# EAGLE design mp3player (EAGLE 4.11)
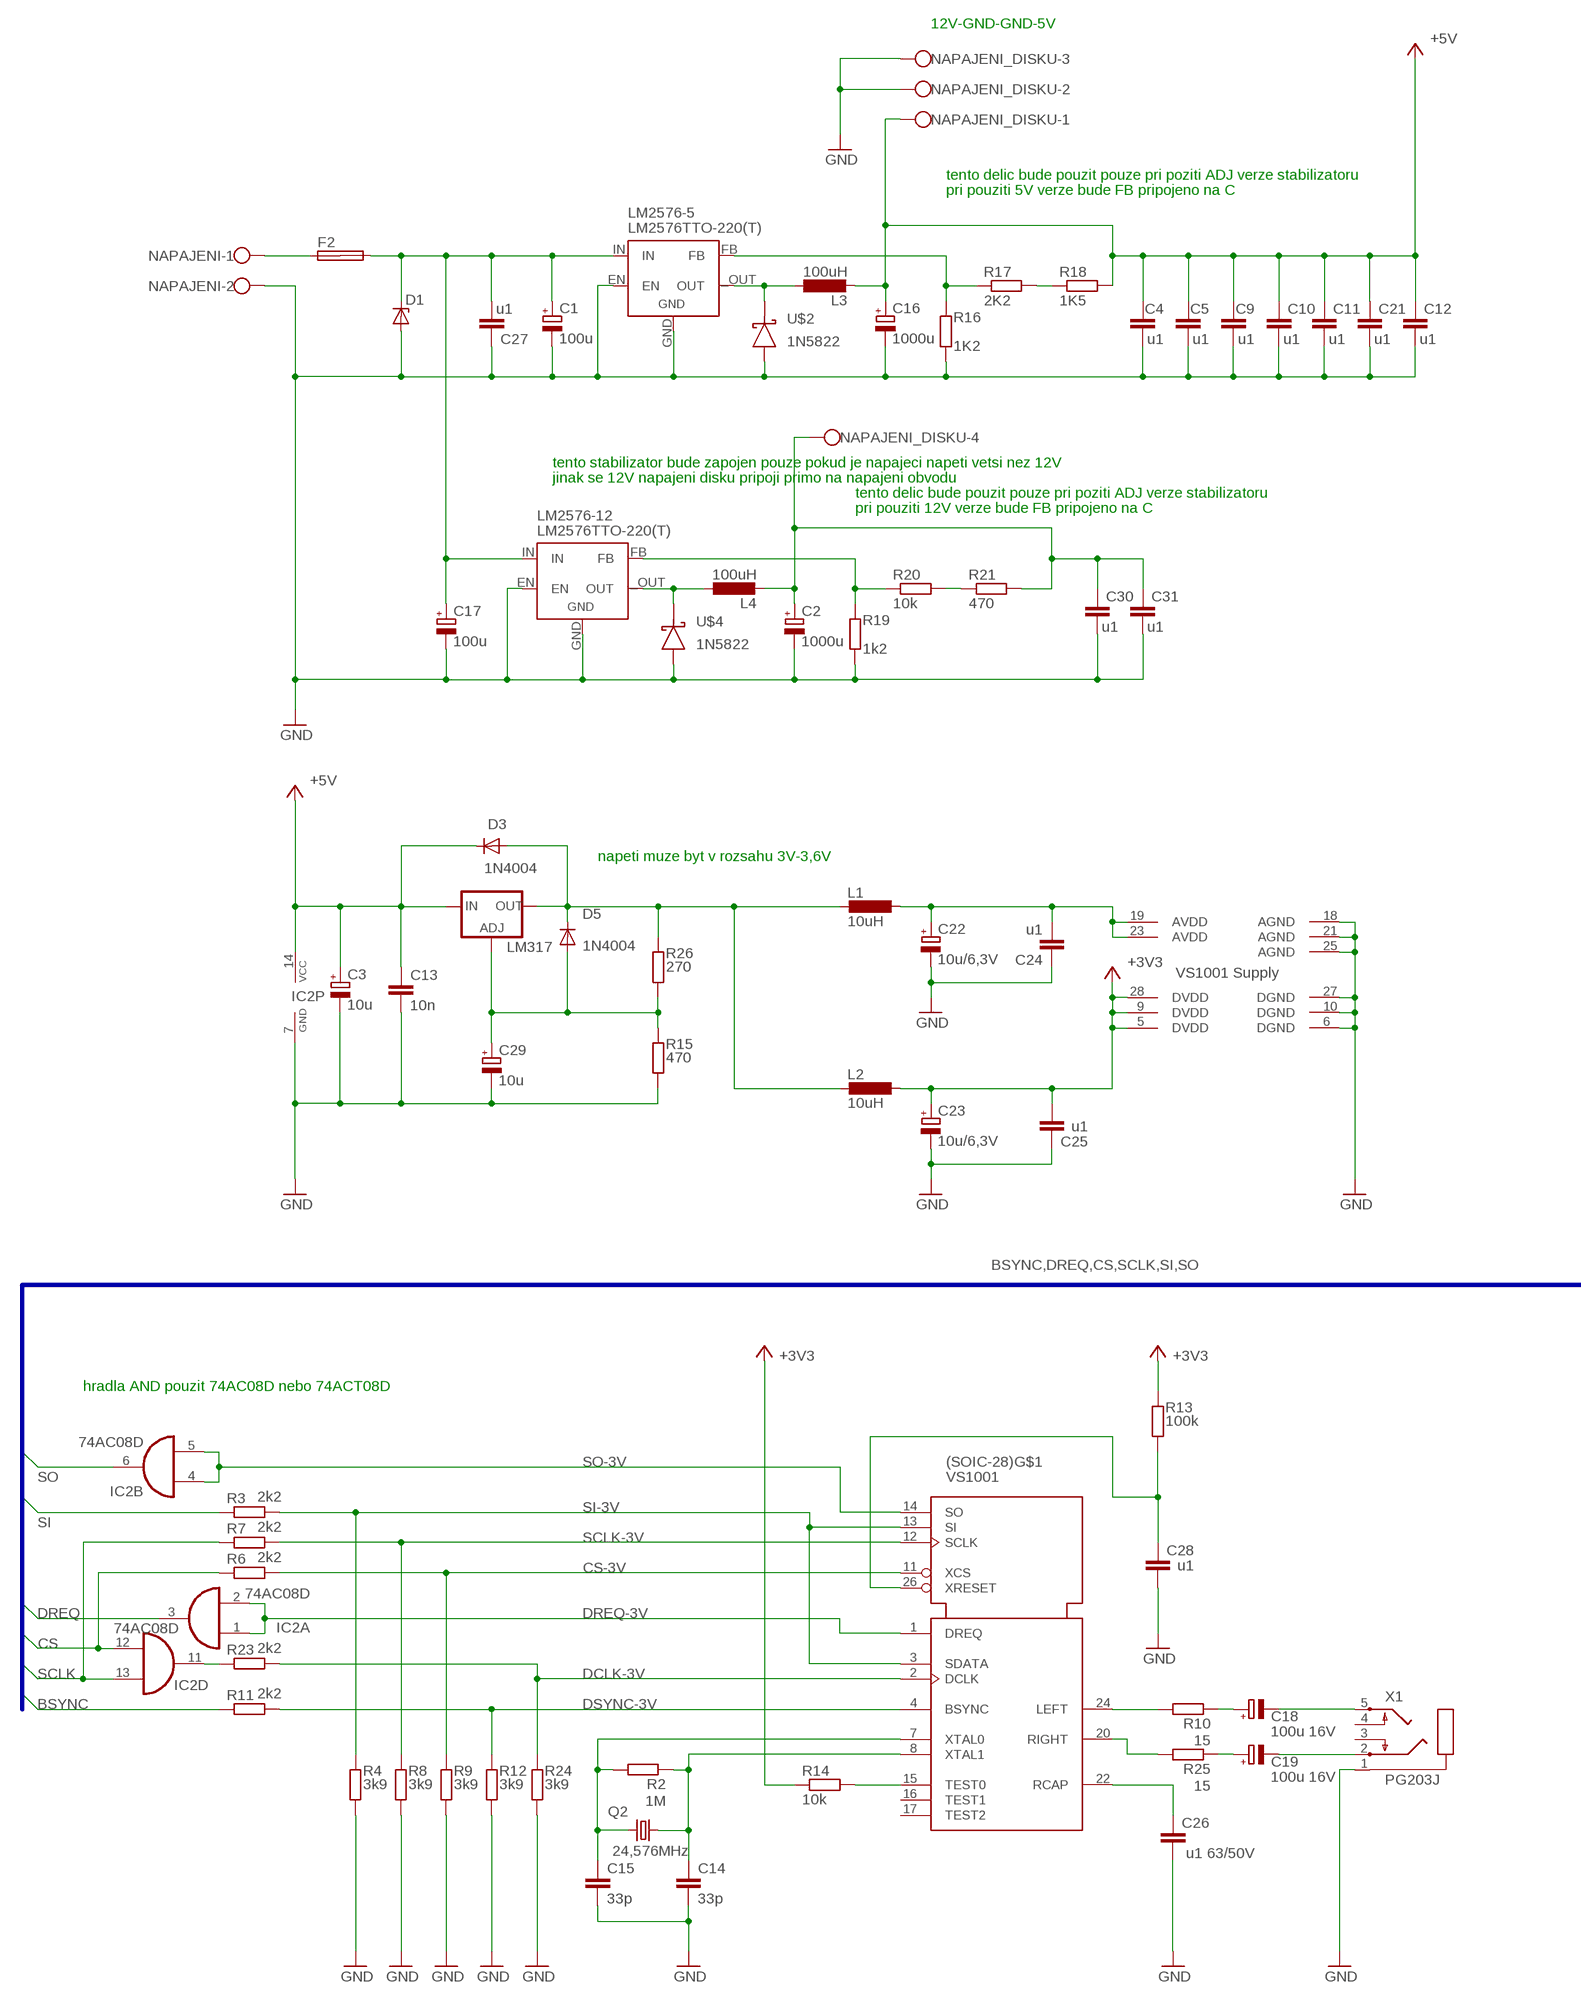
[diagram p0: schematic, sheet 1, part 1 of 2]
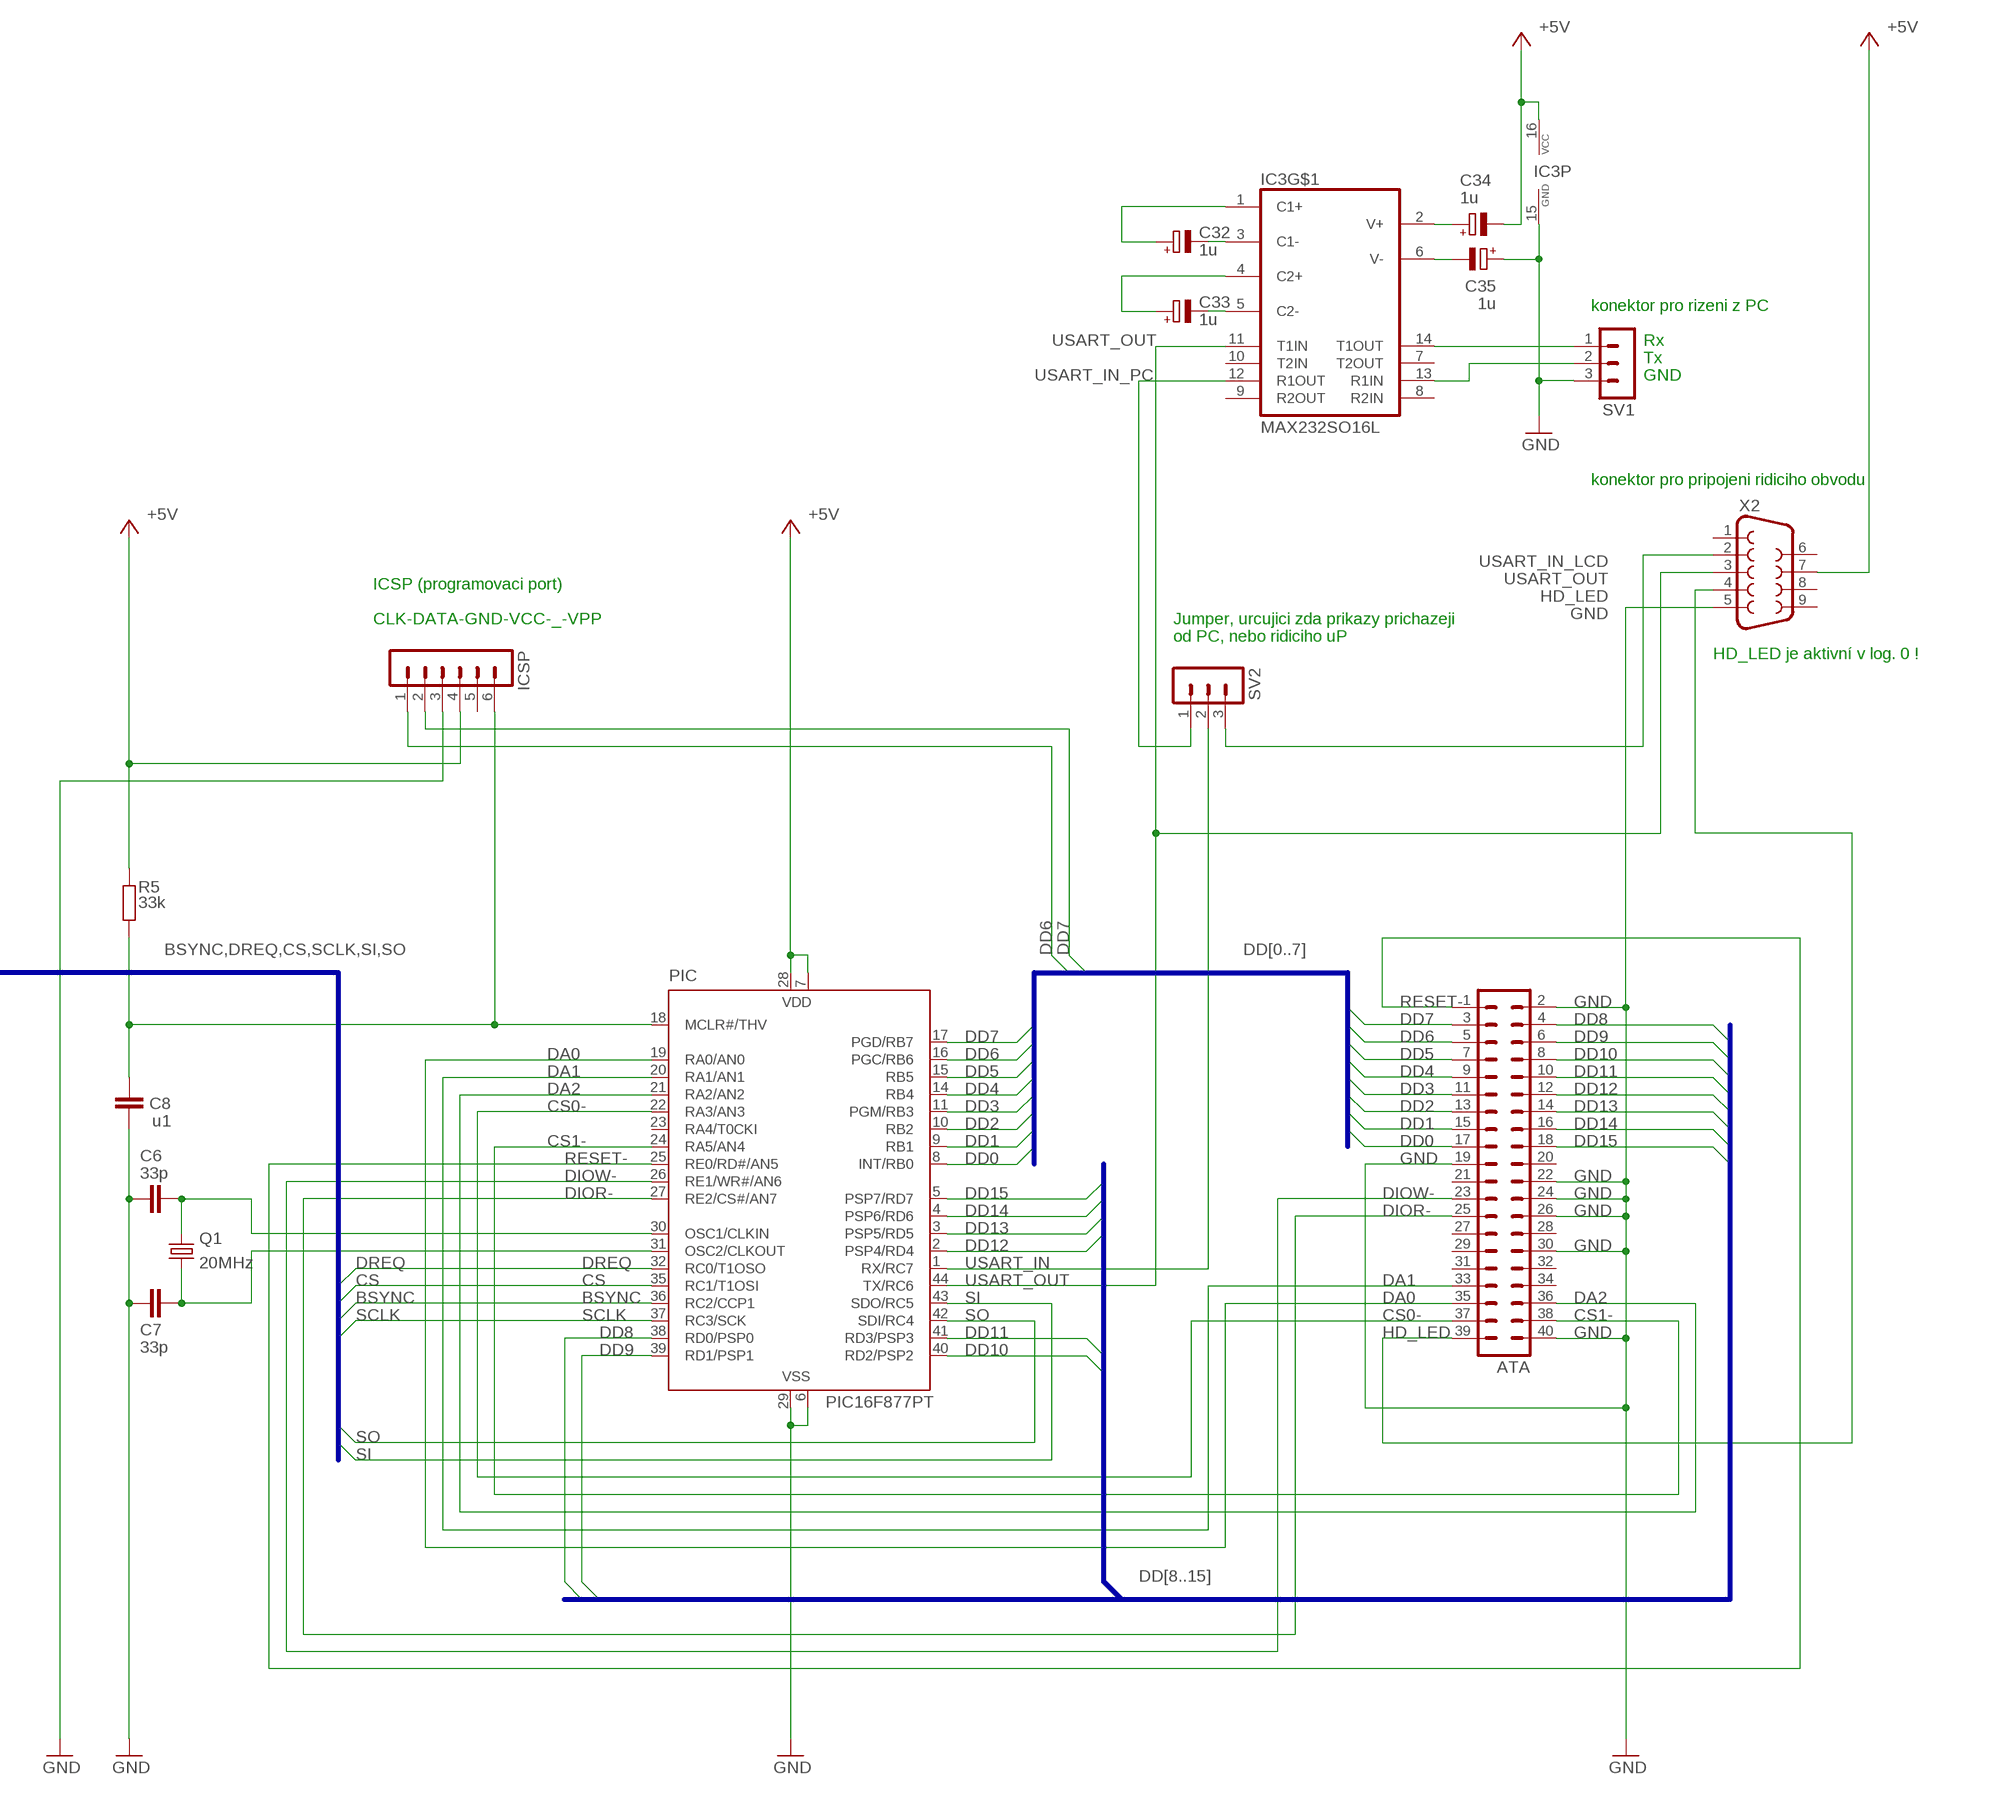
[diagram p1: schematic, sheet 1, part 2 of 2]

## Parts
(SOIC-28)  VS1001-SOIC-28  [SO-28L]
ATA  MA20-2  [MA20-2]
C1  100u  CPOL-EUE3.5-8  [E3,5-8]
C2  1000u  CPOL-EUE7.5-16  [E7,5-16]
C3  10u  CPOL-EUE1.8-4  [E1,8-4]
C4  u1  C-EUC1206  [C1206]
C5  u1  C-EUC1206  [C1206]
C6  33p  C-EUC0805  [C0805]
C7  33p  C-EUC0805  [C0805]
C8  u1  C-EUC1206  [C1206]
C9  u1  C-EUC1206  [C1206]
C10  u1  C-EUC1206  [C1206]
C11  u1  C-EUC1206  [C1206]
C12  u1  C-EUC1206  [C1206]
C13  10n  C-EUC1206  [C1206]
C14  33p  C-EUC1206  [C1206]
C15  33p  C-EUC1206  [C1206]
C16  1000u  CPOL-EUE7.5-16  [E7,5-16]
C17  100u  CPOL-EUE3.5-8  [E3,5-8]
C18  100u 16V  CPOL-EUE2,5-6E  [E2,5-6E]
C19  100u 16V  CPOL-EUE2,5-6E  [E2,5-6E]
C21  u1  C-EUC1206  [C1206]
C22  10u/6,3V  CPOL-EUE1.8-4  [E1,8-4]
C23  10u/6,3V  CPOL-EUE1.8-4  [E1,8-4]
C24  u1  C-EUC1206  [C1206]
C25  u1  C-EUC1206  [C1206]
C26  u1 63/50V  C-EUC1206  [C1206]
C27  u1  C-EUC1206  [C1206]
C28  u1  C-EUC1206  [C1206]
C29  10u  CPOL-EUE1.8-4  [E1,8-4]
C30  u1  C-EUC1206  [C1206]
C31  u1  C-EUC1206  [C1206]
C32  1u  CPOL-EUE2-5  [E2-5]
C33  1u  CPOL-EUE2-5  [E2-5]
C34  1u  CPOL-EUE2-5  [E2-5]
C35  1u  CPOL-EUE2-5  [E2-5]
D1  ZENER-DIODEF126-10  [F126Z10]
D3  1N4004  [DO41-10]
D5  1N4004  [DO41-10]
F2  SHK20L  [SHK20L]
IC2  74AC08D  [SO14]
IC3  MAX232SO16L  [SO16L]
ICSP  MA06-1  [MA06-1]
L1  10uH  L-EUL4516C  [L4516C]
L2  10uH  L-EUL4516C  [L4516C]
L3  100uH  L-EUTJ5-U2  [TJ5-U2]
L4  100uH  L-EUTJ5-U2  [TJ5-U2]
LM317  LM317TS  [317TS]
LM2576-5  LM2576TTO-220(T)  LM2576TTO-220T  [78XXS]
LM2576-12  LM2576TTO-220(T)  LM2576TTO-220T  [78XXS]
NAPAJENI  W237-102  [W237-102]
NAPAJENI_DISKU  W237-4  [W237-4]
PIC  PIC16F877PT  [TQFP44]
Q1  20MHz  CRYTALHC18U-V  [HC18U-V]
Q2  24,576MHz  CRYTALHC18U-V  [HC18U-V]
R2  1M  R-EU_R1206  [R1206]
R3  2k2  R-EU_R1206  [R1206]
R4  3k9  R-EU_R1206  [R1206]
R5  33k  R-EU_R1206  [R1206]
R6  2k2  R-EU_R1206  [R1206]
R7  2k2  R-EU_R1206  [R1206]
R8  3k9  R-EU_R1206  [R1206]
R9  3k9  R-EU_R1206  [R1206]
R10  15  R-EU_R1206  [R1206]
R11  2k2  R-EU_R1206  [R1206]
R12  3k9  R-EU_R1206  [R1206]
R13  100k  R-EU_M1206  [M1206]
R14  10k  R-EU_M1206  [M1206]
R15  470  R-EU_M1206  [M1206]
R16  1K2  R-EU_M1206  [M1206]
R17  2K2  R-EU_M1206  [M1206]
R18  1K5  R-EU_M1206  [M1206]
R19  1k2  R-EU_M1206  [M1206]
R20  10k  R-EU_M1206  [M1206]
R21  470  R-EU_M1206  [M1206]
R23  2k2  R-EU_R1206  [R1206]
R24  3k9  R-EU_R1206  [R1206]
R25  15  R-EU_R1206  [R1206]
R26  270  R-EU_M1206  [M1206]
SV1  MA03-1  [MA03-1]
SV2  MA03-1  [MA03-1]
U$2  1N5822  [DO201]
U$4  1N5822  [DO201]
X1  PG203J  [PG203J]
X2  F09HP  [F09HP]

## Nets
3V: D3.A D5.C L1.2 L2.2 LM317.2(OUT) R26.2
12V: C2.+ C30.2 C31.2 L4.2 NAPAJENI_DISKU.4 R21.2
470: R20.2 R21.1
+3V3: (SOIC-28).5(DVDD) (SOIC-28).9(DVDD) (SOIC-28).28(DVDD) C23.+ C25.2 L2.1 R13.2 R14.2
+5V: C3.+ C4.2 C5.2 C9.2 C10.2 C11.2 C12.2 C13.1 C16.+ C21.2 C34.- D3.C IC2.14(P:VCC) IC3.16(P:VCC) ICSP.4 L3.2 LM317.3(IN) NAPAJENI_DISKU.1 PIC.7(VDD) PIC.28(VDD) R5.2 R18.2 X2.7
AVDD: (SOIC-28).19(AVDD) (SOIC-28).23(AVDD) C22.+ C24.2 L1.1
BSYNC: PIC.36(RC2/CCP1) R11.1
CS: IC2.12(D:I0) PIC.35(RC1/T1OSI) R6.1
CS0-: ATA.37 PIC.22(RA3/AN3)
CS1-: ATA.38 PIC.24(RA5/AN4)
CS-3V: (SOIC-28).11(XCS) R6.2 R9.2
DA0: ATA.35 PIC.19(RA0/AN0)
DA1: ATA.33 PIC.20(RA1/AN1)
DA2: ATA.36 PIC.21(RA2/AN2)
DCLK-3V: (SOIC-28).2(DCLK) R23.2 R24.2
DD0: ATA.17 PIC.8(INT/RB0)
DD1: ATA.15 PIC.9(RB1)
DD2: ATA.13 PIC.10(RB2)
DD3: ATA.11 PIC.11(PGM/RB3)
DD4: ATA.9 PIC.14(RB4)
DD5: ATA.7 PIC.15(RB5)
DD6: ATA.5 ICSP.1 PIC.16(PGC/RB6)
DD7: ATA.3 ICSP.2 PIC.17(PGD/RB7)
DD8: ATA.4 PIC.38(RD0/PSP0)
DD9: ATA.6 PIC.39(RD1/PSP1)
DD10: ATA.8 PIC.40(RD2/PSP2)
DD11: ATA.10 PIC.41(RD3/PSP3)
DD12: ATA.12 PIC.2(PSP4/RD4)
DD13: ATA.14 PIC.3(PSP5/RD5)
DD14: ATA.16 PIC.4(PSP6/RD6)
DD15: ATA.18 PIC.5(PSP7/RD7)
DIOR-: ATA.25 PIC.27(RE2/CS#/AN7)
DIOW-: ATA.23 PIC.26(RE1/WR#/AN6)
DREQ: IC2.3(A:O) PIC.32(RC0/T1OSO)
DREQ-3V: (SOIC-28).1(DREQ) IC2.1(A:I0) IC2.2(A:I1)
DSYNC-3V: (SOIC-28).4(BSYNC) R11.2 R12.2
GND: (SOIC-28).6(DGND) (SOIC-28).10(DGND) (SOIC-28).18(AGND) (SOIC-28).21(AGND) (SOIC-28).25(AGND) (SOIC-28).27(DGND) ATA.2 ATA.19 ATA.22 ATA.24 ATA.26 ATA.30 ATA.40 C1.- C2.- C3.- C4.1 C5.1 C6.1 C7.1 C8.1 C9.1 C10.1 C11.1 C12.1 C13.2 C14.2 C15.2 C16.- C17.- C21.1 C22.- C23.- C24.1 C25.1 C26.1 C27.1 C28.1 C29.- C30.1 C31.1 C35.+ D1.A IC2.7(P:GND) IC3.15(P:GND) ICSP.3 LM2576-5.EN LM2576-5.GND LM2576-12.EN LM2576-12.GND NAPAJENI.2 NAPAJENI_DISKU.2 NAPAJENI_DISKU.3 PIC.6(VSS) PIC.29(VSS) R4.1 R8.1 R9.1 R12.1 R15.1 R16.1 R19.1 R24.1 SV1.3 U$2.A U$4.A X1.1 X2.5
HD_LED: ATA.39 X2.4
MCLR-: C8.2 ICSP.6 PIC.18(MCLR#/THV) R5.1
N$1: F2.1A NAPAJENI.1
N$2: C7.2 PIC.31(OSC2/CLKOUT) Q1.1
N$5: C6.2 PIC.30(OSC1/CLKIN) Q1.2
N$7: (SOIC-28).15(TEST0) R14.1
N$8: (SOIC-28).8(XTAL1) C14.1 Q2.1 R2.1
N$9: (SOIC-28).7(XTAL0) C15.1 Q2.2 R2.2
N$11: (SOIC-28).22(RCAP) C26.2
N$12: C18.- X1.5
N$13: C19.- X1.2
N$14: C18.+ R10.1
N$15: C19.+ R25.1
N$23: (SOIC-28).26(XRESET) C28.2 R13.1
N$25: C1.+ C17.+ C27.2 D1.C F2.2A LM2576-5.IN LM2576-12.IN
N$28: C29.+ D5.A LM317.1(ADJ) R15.2 R26.1
N$29: L4.1 LM2576-12._OUT(OUT) U$4.K
N$30: IC3.14(T1OUT) SV1.1
N$31: L3.1 LM2576-5._OUT(OUT) U$2.K
N$32: R17.2 R18.1
N$33: LM2576-5.FB R16.2 R17.1
N$34: IC3.13(R1IN) SV1.2
N$35: LM2576-12.FB R19.2 R20.1
N$36: C35.- IC3.6(V-)
N$37: C34.+ IC3.2(V+)
N$38: C33.- IC3.5(C2-)
N$39: C32.- IC3.3(C1-)
N$40: C32.+ IC3.1(C1+)
N$41: C33.+ IC3.4(C2+)
N$55: (SOIC-28).20(RIGHT) R25.2
N$56: (SOIC-28).24(LEFT) R10.2
N$57: IC2.11(D:O) R23.1
RESET-: ATA.1 PIC.25(RE0/RD#/AN5)
SCLK: IC2.13(D:I1) PIC.37(RC3/SCK) R7.1
SCLK-3V: (SOIC-28).12(SCLK) R7.2 R8.2
SI: PIC.43(SDO/RC5) R3.1
SI-3V: (SOIC-28).3(SDATA) (SOIC-28).13(SI) R3.2 R4.2
SO: IC2.6(B:O) PIC.42(SDI/RC4)
SO-3V: (SOIC-28).14(SO) IC2.4(B:I0) IC2.5(B:I1)
USART_IN: PIC.1(RX/RC7) SV2.2
USART_IN_LCD: SV2.3 X2.2
USART_IN_PC: IC3.12(R1OUT) SV2.1
USART_OUT: IC3.11(T1IN) PIC.44(TX/RC6) X2.3
Unconnected: (SOIC-28).16(TEST1) (SOIC-28).17(TEST2) ATA.20 ATA.21 ATA.27 ATA.28 ATA.29 ATA.31 ATA.32 ATA.34 F2.1B F2.2B IC2.8(C:O) IC2.9(C:I0) IC2.10(C:I1) IC3.7(T2OUT) IC3.8(R2IN) IC3.9(R2OUT) IC3.10(T2IN) ICSP.5 PIC.23(RA4/T0CKI) X1.3 X1.4 X2.1 X2.6 X2.8 X2.9

## Buses
DD[0..7]
DD[8..15]
BSYNC,DREQ,CS,SCLK,SI,SO

## Notes on the sheet
- 12V-GND-GND-5V
- tento delic bude pouzit pouze pri poziti ADJ verze stabilizatoru
- pri pouziti 5V verze bude FB pripojeno na C
- tento stabilizator bude zapojen pouze pokud je napajeci napeti vetsi nez 12V
- jinak se 12V napajeni disku pripoji primo na napajeni obvodu
- tento delic bude pouzit pouze pri poziti ADJ verze stabilizatoru
- pri pouziti 12V verze bude FB pripojeno na C
- konektor pro rizeni z PC
- Rx
- Tx
- GND
- napeti muze byt v rozsahu 3V-3,6V | konektor pro pripojeni ridiciho obvodu
- ICSP (programovaci port)
- CLK-DATA-GND-VCC-_-VPP | Jumper, urcujici zda prikazy prichazeji
- od PC, nebo ridiciho uP
- HD_LED je aktivní v log. 0 !
- hradla AND pouzit 74AC08D nebo 74ACT08D

## Library data of the parts
(SOIC-28) = vs1001:VS1001: MP3 decoder chip from VLSI Solutions
ATA = con-lstb:MA20-2: PIN HEADER
C1-C3 C16-C19 C22 C23 C29 C32-C35 = rcl:CPOL-EU: POLARIZED CAPACITOR, European symbol
C4-C15 C21 C24-C28 C30 C31 = rcl:C-EU: CAPACITOR, European symbol
D1 = diode:ZENER-DIODE: Z-Diode
D3 D5 = diode:1N4004: DIODE general purpose rectifier, 1 A
F2 = fuse:SHK20L: FUSE HOLDER 5 x 20 mm, SH contact, SHH1 Schukat, E1073 Buerklin
IC2 = 74xx-eu:74*08: Quad 2-input AND gate
IC3 = MP3 PREHRAVAC:MAX232: RS232 TRANSEIVER
ICSP = con-lstb:MA06-1: PIN HEADER
L1-L4 = rcl:L-EU: INDUCTOR, European symbol
LM317 = v-reg:LM317TS: VOLTAGE REGULATOR
LM2576-5 LM2576-12 = MP3 PREHRAVAC:LM2576T
NAPAJENI = con-wago-500:W237-102: WAGO SCREW CLAMP
NAPAJENI_DISKU = con-wago-500:W237-4: WAGO SCREW CLAMP
PIC = microchip:PIC16F87*: MICROCONTROLLER
Q1 Q2 = crystal:CRYTAL: CRYSTAL
R2-R21 R23-R26 = rcl:R-EU_: RESISTOR, European symbol
SV1 SV2 = con-lstb:MA03-1: PIN HEADER
U$2 U$4 = MP3 PREHRAVAC:1N5822
X1 = con-hirschmann:PG203J: MIC/HEADPHONE JACK KS-S stereo microphone/headphone jack PG203JN (Schukat)
X2 = con-subd:F09: SUB-D

## Board
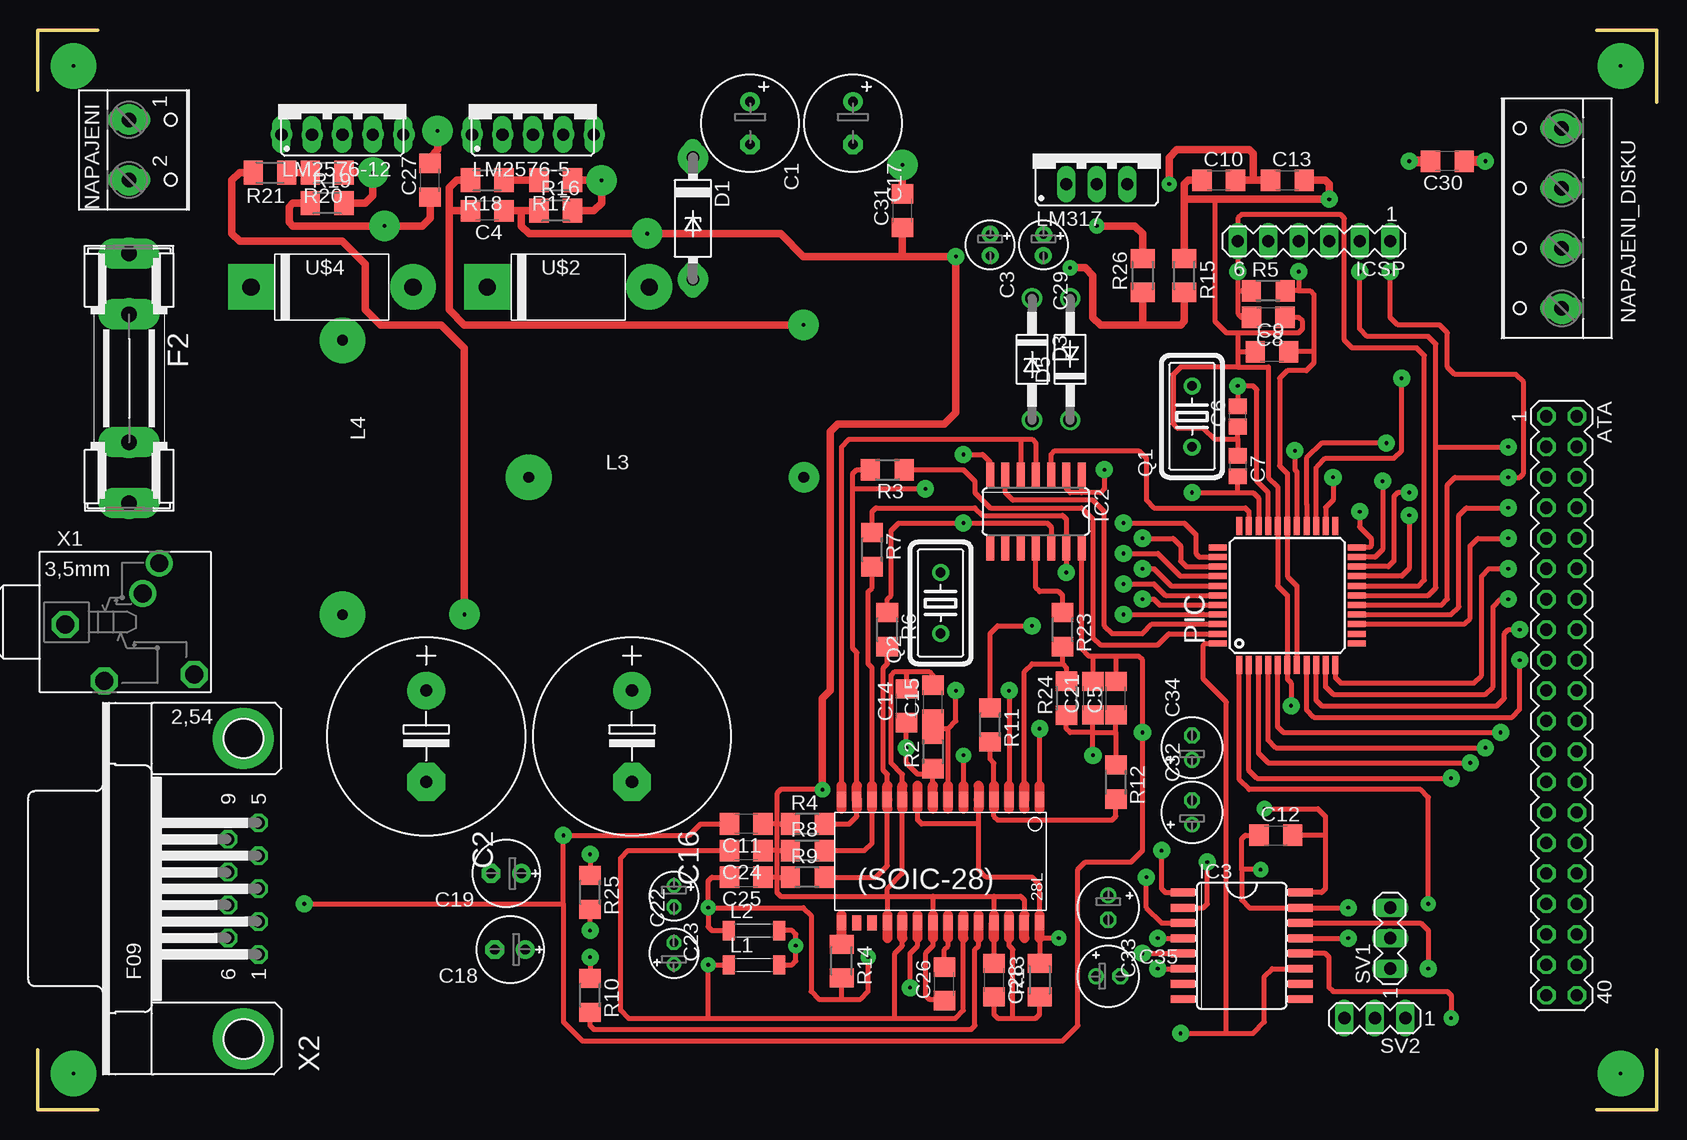
[diagram p2: board, top side]
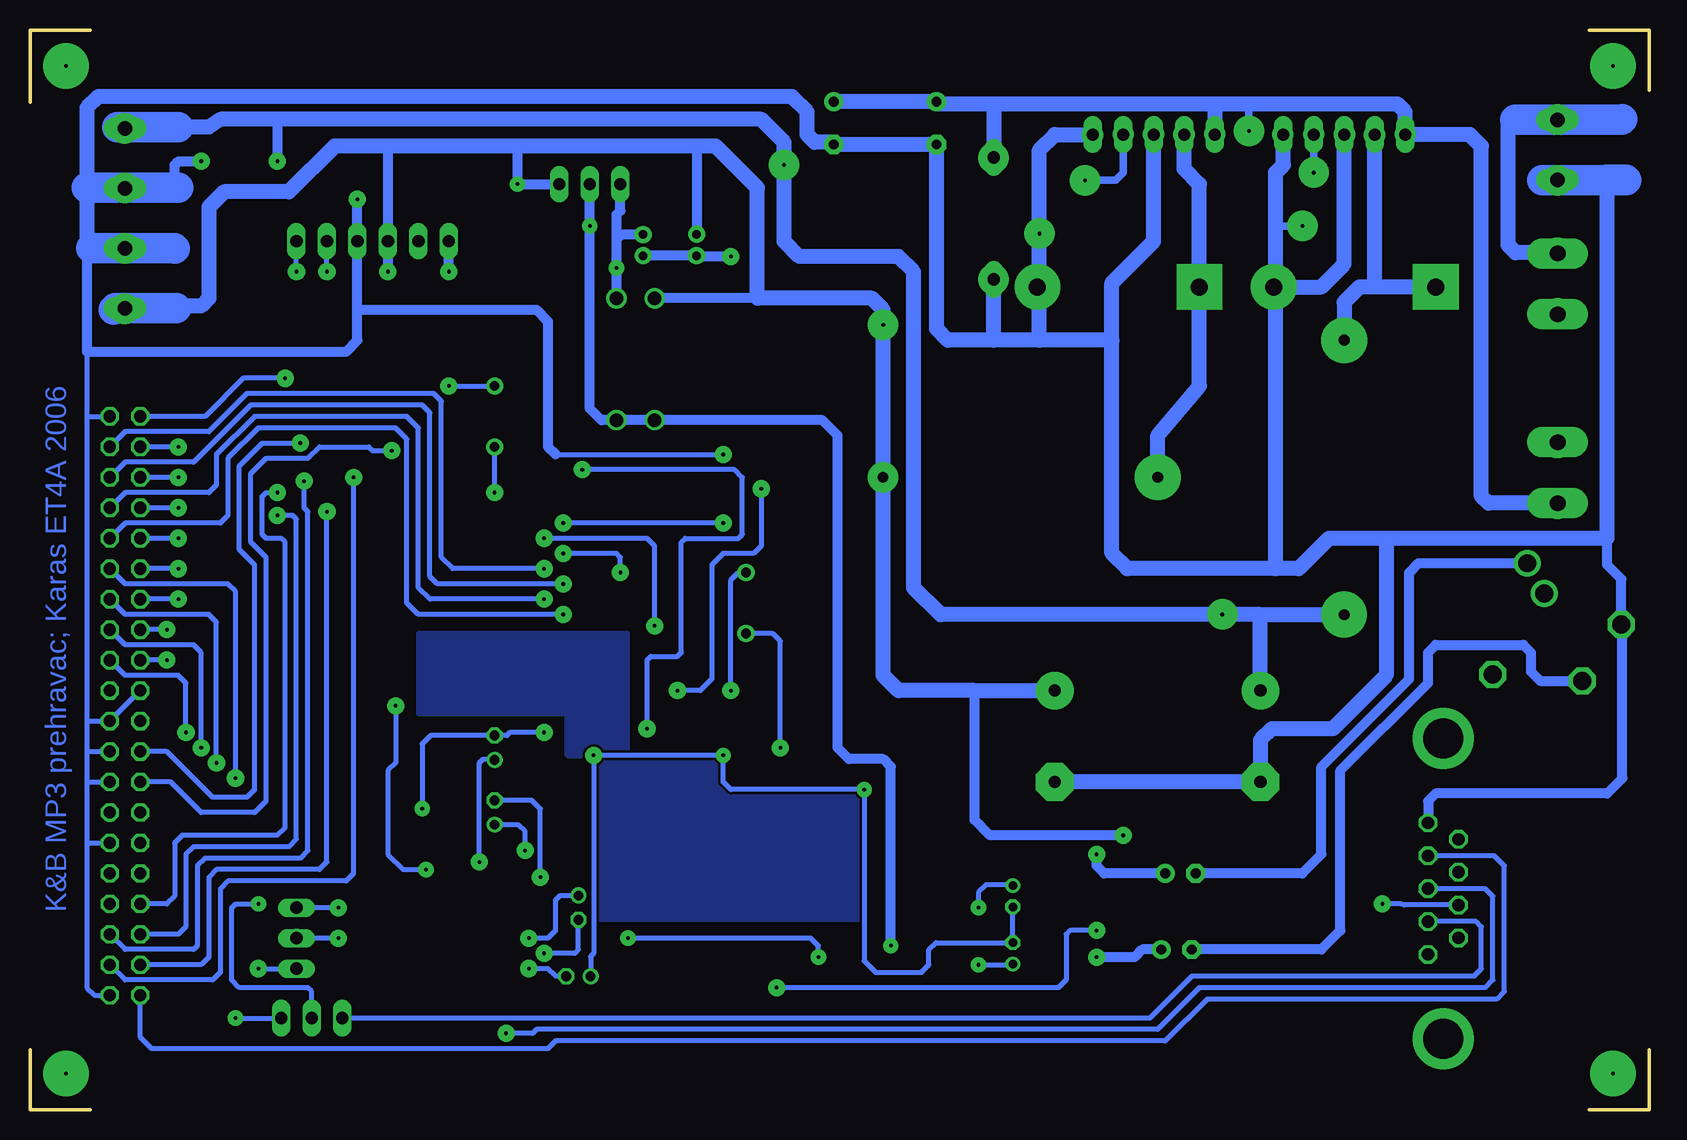
[diagram p3: board, bottom side, seen from below]

Size 134.92 x 90 mm. Coordinates in mm from the lower left corner, seen from the top.
Outline: 5,90 0,90 0,85
Outline: 0,5 0,0 5,0
Outline: 134.92,84 134.92,90 129.92,90
Outline: 134.92,5 134.92,0 129.92,0
Copper layers (1*16): Top 0.035mm / dielectric 1.5mm / Bottom 0.035mm
Design rules "default": minimum track width 10mil, minimum drill 24mil, track to track 8mil, track to pad 8mil, pad to pad 8mil, via to via 8mil, smd to smd 8mil, copper to edge 40mil, drill to drill 8mil, minimum pad ring 10mil, minimum via ring 8mil, stop-mask expansion 4mil, vias tented up to drill 0mil, thermal gap 10mil

### Footprints (pad centres in the part's own frame; a part is rotated, then mirrored left to right if it is on the bottom)
SO-28L = smd 0.762 x 1.27: 1 -7.62,-5.207; 2 -6.35,-5.207; 3 -5.08,-5.207; 4 -3.81,-5.207; 5 -2.54,-5.207; 6 -1.27,-5.207; 7 0,-5.207; 8 1.27,-5.207; 9 2.54,-5.207; 10 3.81,-5.207; 11 5.08,-5.207; 12 6.35,-5.207; 13 7.62,-5.207; 14 8.89,-5.207; 15 8.89,5.08; 16 7.62,5.08; 17 6.35,5.08; 18 5.08,5.08; 19 3.81,5.08; 20 2.54,5.08; 21 1.27,5.08; 22 0,5.08; 23 -1.27,5.08; 24 -2.54,5.08; 25 -3.81,5.08; 26 -5.08,5.08; 27 -6.35,5.08; 28 -7.62,5.08
MA20-2 = drill 1.016 octagon: 1 -24.13,-1.27; 2 -24.13,1.27; 3 -21.59,-1.27; 4 -21.59,1.27; 5 -19.05,-1.27; 6 -19.05,1.27; 7 -16.51,-1.27; 8 -16.51,1.27; 9 -13.97,-1.27; 10 -13.97,1.27; 11 -11.43,-1.27; 12 -11.43,1.27; 13 -8.89,-1.27; 14 -8.89,1.27; 15 -6.35,-1.27; 16 -6.35,1.27; 17 -3.81,-1.27; 18 -3.81,1.27; 19 -1.27,-1.27; 20 -1.27,1.27; 21 1.27,-1.27; 22 1.27,1.27; 23 3.81,-1.27; 24 3.81,1.27; 25 6.35,-1.27; 26 6.35,1.27; 27 8.89,-1.27; 28 8.89,1.27; 29 11.43,-1.27; 30 11.43,1.27; 31 13.97,-1.27; 32 13.97,1.27; 33 16.51,-1.27; 34 16.51,1.27; 35 19.05,-1.27; 36 19.05,1.27; 37 21.59,-1.27; 38 21.59,1.27; 39 24.13,-1.27; 40 24.13,1.27
E3,5-8 = drill 0.813 pad 1.6 round: + -1.778,0 | drill 0.813 pad 1.6 octagon: - 1.778,0
E7,5-16 = drill 1.016 pad 3.15 round: + -3.81,0 | drill 1.016 pad 3.15 octagon: - 3.81,0
E1,8-4 = drill 0.711 pad 1.168 round: + -0.889,0 | drill 0.711 pad 1.168 octagon: - 0.889,0
C1206 = smd 1.6 x 1.8: 1 -1.4,0; 2 1.4,0
C0805 = smd 1.3 x 1.5: 1 -0.85,0; 2 0.85,0
E2,5-6E = drill 0.813 pad 1.575 round: + -1.27,0 | drill 0.813 pad 1.575 octagon: - 1.27,0
E2-5 = drill 0.813 pad 1.27 round: + -1.016,0 | drill 0.813 pad 1.27 octagon: - 1.016,0
F126Z10 = drill 1.016 long: A 5.08,0; C -5.08,0
DO41-10 = drill 1.118 round: A 5.08,0; C -5.08,0
SHK20L = drill 1.321 pad 2.54 long: 1A -10.414,0; 1B -5.334,0; 2A 10.414,0; 2B 5.334,0
SO14 = smd 0.66 x 2.032: 1 -3.81,-3.073; 2 -2.54,-3.073; 3 -1.27,-3.073; 4 0,-3.073; 5 1.27,-3.073; 6 2.54,-3.073; 7 3.81,-3.073; 8 3.81,3.073; 9 2.54,3.073; 10 1.27,3.073; 11 0,3.073; 12 -1.27,3.073; 13 -2.54,3.073; 14 -3.81,3.073
SO16L = smd 0.66 x 2.032: 1 -4.445,-4.902; 2 -3.175,-4.902; 3 -1.905,-4.902; 4 -0.635,-4.902; 5 0.635,-4.902; 6 1.905,-4.902; 7 3.175,-4.902; 8 4.445,-4.902; 9 4.445,4.902; 10 3.175,4.902; 11 1.905,4.902; 12 0.635,4.902; 13 -0.635,4.902; 14 -1.905,4.902; 15 -3.175,4.902; 16 -4.445,4.902
MA06-1 = drill 1.016 long: 1 -6.35,0; 2 -3.81,0; 3 -1.27,0; 4 1.27,0; 5 3.81,0; 6 6.35,0
L4516C = smd 1 x 1.6: 1 -2.1,0; 2 2.1,0
TJ5-U2 = drill 0.9 round: 1 -11.45,0; 2 11.45,0
317TS = drill 1.016 long: 1 -2.54,-2.54; 2 0,-2.54; 3 2.54,-2.54
78XXS = drill 1.016 long: _OUT -2.54,-2.54; EN 5.08,-2.54; FB 2.54,-2.54; GND 0,-2.54; IN -5.08,-2.54; OUT 0,-2.54; OUT1 0,-2.54
W237-102 = drill 1.194 long: 1 -2.5,-1.27; 2 2.5,-1.27
W237-4 = drill 1.194 long: 1 -7.5,-1.27; 2 -2.5,-1.27; 3 2.5,-1.27; 4 7.5,-1.27
TQFP44 = smd 1.5 x 0.5: 1 -5.8,4; 2 -5.8,3.2; 3 -5.8,2.4; 4 -5.8,1.6; 5 -5.8,0.8; 6 -5.8,0; 7 -5.8,-0.8; 8 -5.8,-1.6; 9 -5.8,-2.4; 10 -5.8,-3.2; 11 -5.8,-4; 23 5.8,-4; 24 5.8,-3.2; 25 5.8,-2.4; 26 5.8,-1.6; 27 5.8,-0.8; 28 5.8,0; 29 5.8,0.8; 30 5.8,1.6; 31 5.8,2.4; 32 5.8,3.2; 33 5.8,4 | smd 0.5 x 1.5: 12 -4,-5.8; 13 -3.2,-5.8; 14 -2.4,-5.8; 15 -1.6,-5.8; 16 -0.8,-5.8; 17 0,-5.8; 18 0.8,-5.8; 19 1.6,-5.8; 20 2.4,-5.8; 21 3.2,-5.8; 22 4,-5.8; 34 4,5.8; 35 3.2,5.8; 36 2.4,5.8; 37 1.6,5.8; 38 0.8,5.8; 39 0,5.8; 40 -0.8,5.8; 41 -1.6,5.8; 42 -2.4,5.8; 43 -3.2,5.8; 44 -4,5.8
HC18U-V = drill 0.813 round: 1 -2.54,0; 2 2.54,0
R1206 = smd 1.6 x 1.803: 1 -1.422,0; 2 1.422,0
M1206 = smd 1.6 x 2: 1 -1.4,0; 2 1.4,0
MA03-1 = drill 1.016 long: 1 -2.54,0; 2 0,0; 3 2.54,0
DO201 = drill 1.422 pad 3.81 round: A 13.5,0 | drill 1.422 pad 3.81 square: K 0,0
PG203J = drill 1.499 octagon: 1 -5.004,-0.203; 4 5.74,-4.369; 5 -1.753,-4.902 | drill 1.499 round: 2 2.845,4.902; 3 1.448,2.388
F09HP = drill 1.016 octagon: 1 -5.486,-1.27; 2 -2.743,-1.27; 3 0,-1.27; 4 2.743,-1.27; 5 5.486,-1.27; 6 -4.115,1.27; 7 -1.372,1.27; 8 1.372,1.27; 9 4.115,1.27 | drill 3.302 pad 5.08 round: G1 -12.522,0; G2 12.522,0

### Placement (x,y rotation side)
(SOIC-28)  75.88,20.64 180 top
ATA  127,33.66 270 top
C1  59.37,82.23 270 top
C2  32.38,31.11 270 top
C3  79.38,72.07 270 top
C4  37.47,74.93 180 top
C5  89.85,34.29 90 top
C6  100.01,57.78 90 top
C7  100.01,53.66 270 top
C8  102.55,66.04 180 top
C9  102.87,63.18 0 top
C10  98.42,77.47 0 top
C11  59.05,23.81 180 top
C12  103.19,22.86 0 top
C13  104.14,77.47 0 top
C14  72.39,33.66 90 top
C15  74.61,33.97 90 top
C16  49.53,31.11 270 top
C17  67.94,82.23 270 top
C18  39.37,13.34 180 top
C19  39.05,19.68 180 top
C21  87.95,34.29 90 top
C22  53.02,13.02 90 top
C23  53.02,17.78 270 top
C24  59.05,21.59 180 top
C25  59.05,19.37 180 top
C26  75.56,10.48 90 top
C27  32.7,77.47 90 top
C28  79.69,10.79 270 top
C29  83.82,72.07 270 top
C30  117.47,79.06 180 top
C31  72.07,74.93 90 top
C32  96.2,24.77 90 top
C33  89.22,16.83 270 top
C34  96.2,30.16 90 top
C35  89.22,11.11 0 top
D1  54.61,74.3 270 top
D3  82.87,62.55 270 top
D5  86.04,62.55 90 top
F2  7.62,60.96 270 top
IC2  83.19,49.85 180 top
IC3  100.33,13.65 270 top
ICSP  106.36,72.39 180 top
L1  59.69,12.06 0 top
L2  59.69,14.92 0 top
L3  52.39,52.7 0 top
L4  25.4,52.7 270 top
LM317  88.27,79.69 0 top
LM2576-5  41.27,83.82 0 top
LM2576-12  25.4,83.82 0 top
NAPAJENI  8.89,80.01 270 top
NAPAJENI_DISKU  125.73,74.3 90 top
PIC  104.14,42.86 90 top
Q1  96.2,57.78 90 top
Q2  75.25,42.23 90 top
R2  74.61,29.84 90 top
R3  70.8,53.34 180 top
R4  64.14,23.81 0 top
R5  102.55,68.26 0 top
R6  70.8,40.01 270 top
R7  69.53,46.67 270 top
R8  64.14,21.59 0 top
R9  64.14,19.37 0 top
R10  46.04,9.53 270 top
R11  79.38,32.07 270 top
R12  89.85,27.3 270 top
R13  83.5,10.79 90 top
R14  66.99,12.38 270 top
R15  95.57,69.53 270 top
R16  43.18,74.93 0 top
R17  43.18,77.47 180 top
R18  37.47,77.47 180 top
R19  24.13,75.56 0 top
R20  24.13,78.11 180 top
R21  19.37,78.11 180 top
R23  85.41,40.01 270 top
R24  85.72,34.29 90 top
R25  46.04,18.1 270 top
R26  92.08,69.53 90 top
SV1  112.71,14.29 90 top
SV2  111.44,7.62 180 top
U$2  37.47,68.58 0 top
U$4  17.78,68.58 0 top
X1  7.3,40.64 0 top
X2  17.14,18.41 90 top

### Tracks (layer width: path | path; a pad name or v marks a point on that pad's centre or on a via)
3V  (via drill 0.3 pad 1.27)
  Top 0.406: L1.2 62.87,12.06 63.18,12.38 v63.18,13.65 63.18,14.61 62.87,14.92 L2.2
  Top 0.61: v88.27,73.66 91.44,73.66 92.08,73.03 R26.2
  Bottom 0.813: v63.18,13.65 63.18,28.57 63.82,29.21 66.67,29.21 67.63,30.16 67.63,56.2 68.9,57.47 D3.A D5.C 87.31,57.47 88.27,58.42 v88.27,73.66 LM317.2
12V  (via drill 0.3 pad 1.42, 0.3 pad 2.54)
  Top 0.61: v35.56,41.27 35.56,63.5 33.66,65.41 28.57,65.41 27.3,66.67 27.3,70.48 25.4,72.39 16.83,72.39 16.19,73.03 16.19,77.47 16.83,78.11 R21.2 | v72.07,78.74 C31.2
  Top 0.813: v114.3,79.06 C30.2
  Bottom 0.61: 35.54,41.26 v35.56,41.27 34.92,41.27 34.92,41.26
  Bottom 0.813: 114.3,82.55 v114.3,79.06
  Bottom 1.27: 25.4,41.27 L4.2 32.38,41.26 | 32.38,41.26 34.92,41.26 59.03,41.26 61.28,43.5 61.28,69.85 62.55,71.12 70.8,71.12 72.07,72.39 v72.07,78.74 | v72.07,78.74 72.07,79.06 | 72.07,79.06 72.07,80.64 73.98,82.55 114.3,82.55 119.06,82.55 120.02,81.92 122.56,81.92 | 72.07,79.06 71.75,79.06 v72.07,78.74 | NAPAJENI_DISKU.4 127.2,81.8 127.32,81.92 | C2.+ 32.38,41.26
  Bottom 2.54: 122.56,81.92 127.32,81.92 127.64,81.92
470
  Top 0.61: R21.1 R20.2
+3V3  (via drill 0.3 pad 1.27)
  Top 0.406: 78.42,23.81 73.66,23.81 73.34,24.13 73.34,25.08 | 78.42,23.81 78.42,20 79.06,19.37 82.87,19.37 83.5,18.73 83.5,16.19 | R13.2 83.5,14.29 v85.09,14.29 | 78.42,23.81 78.42,26.99 | L2.1 56.2,14.92 55.88,15.24 v55.88,16.83 | v55.88,16.83 55.88,19.05 56.2,19.37 C25.2 | v55.88,16.83 63.82,16.83 64.45,16.19 64.45,9.84 65.09,9.21 66.99,9.21 | 66.99,9.21 R14.2 | v69.22,12.7 69.22,9.84 68.58,9.21 66.99,9.21
  Top 0.813: 83.5,14.29 (SOIC-28).28 83.5,16.19 | 78.42,25.08 (SOIC-28).5 78.42,26.99 | 73.34,26.99 (SOIC-28).9 73.34,25.08
  Bottom 0.406: v69.22,12.7 69.22,13.65 69.85,14.29 v85.09,14.29 | v55.88,16.83 55.88,18.1 55.24,18.73 53.02,18.73 C23.+
+5V  (via drill 0.3 pad 1.27, 0.3 pad 1.42, 0.3 pad 2.54)
  Top 0.406: PIC.7 104.94,43.65 104.14,44.45 PIC.28 104.14,53.02 103.5,53.66 103.5,60.96 104.14,61.59 105.73,61.59 106.36,62.23 106.36,63.18 | 43.81,17.14 43.81,7.3 45.4,5.71 85.41,5.71 86.68,6.99 86.68,20 87.31,20.64 91.12,20.64 92.08,21.59 v92.08,31.43 92.08,37.47 91.76,37.78 89.85,37.78 | 43.81,17.14 v43.81,22.86 54.29,22.86 55.24,23.81 C11.2 | 106.36,63.18 C9.2 | 105.09,68.26 R5.2 | v105.09,69.85 105.09,68.26 | 105.09,68.26 106.05,68.26 106.36,67.94 106.36,63.18 | 89.85,37.78 C5.2 | 87.95,37.78 C21.2 | 89.85,37.78 87.95,37.78 | 87.95,37.78 87.63,37.78 87,38.42 IC2.14 87,46.99 | v22.23,17.14 43.81,17.14 | 107.31,22.86 C12.2 | 107.31,22.86 107.31,18.41 107,18.1 IC3.16 | v102.23,25.08 106.68,25.08 107.31,24.45 107.31,22.86
  Top 0.61: R18.2 34.92,77.47 34.29,76.83 34.29,74.93 | 34.29,74.93 34.29,66.67 35.56,65.41 v63.82,65.41 | v94.3,77.15 94.3,79.38 94.93,80.01 100.97,80.01 101.28,79.69 101.28,77.47 | 34.29,74.93 C4.2 | 101.28,77.47 C10.2 | 101.28,77.47 C13.1
  Bottom 0.406: 82.86,80.39 82.86,80.01 82.87,80.01 82.87,80.33 | 79.38,80.33 80.01,80.64 | v102.23,25.08 102.23,30.48 101.54,31.18 C34.- 95.19,31.18 94.93,31.43 v92.08,31.43 | X2.7 20.42,17.04 20.64,17.14 v22.23,17.14
  Bottom 0.61: v94.3,77.15 LM317.3
  Bottom 0.813: v105.09,69.85 ICSP.4 105.09,80.33 | v43.81,22.86 54.93,22.86 56.2,24.13 56.2,34.92 | 79.38,80.33 C3.+ | 74.3,67.63 D3.C | LM317.3 v94.3,77.15 94.3,80.33
  Bottom 1.27: C16.+ 56.2,34.92 62.55,34.92 63.82,36.2 63.82,52.39 | L3.2 63.82,52.7 63.82,52.39 | 122.75,66.8 121.6,66.99 120.65,66.99 120.02,67.63 120.02,75.25 118.75,76.52 113.35,76.52 109.54,80.33 105.09,80.33 94.3,80.33 82.87,80.33 79.38,80.33 77.79,80.33 74.3,76.83 74.3,67.63 64.77,67.63 63.82,66.67 v63.82,65.41 63.82,52.39
  Bottom 2.54: 122.75,66.8 NAPAJENI_DISKU.1 127.83,66.8 127.95,66.67
AVDD  (via drill 0.3 pad 1.27)
  Top 0.406: 55.88,7.62 49.21,7.62 48.58,8.26 48.58,20.95 49.21,21.59 C24.2 | 55.88,7.62 71.44,7.62 | 71.44,7.62 76.52,7.62 77.15,8.26 77.15,14.29 | 71.44,7.62 71.44,13.02 72.07,13.65 72.07,14.29 | L1.1 v55.88,12.06 55.88,7.62
  Top 0.813: 77.15,16.19 (SOIC-28).23 77.15,14.29 | 72.07,16.19 (SOIC-28).19 72.07,14.29
  Bottom 0.406: C22.+ 53.02,12.06 v55.88,12.06
BSYNC  (via drill 0.3 pad 1.42)
  Top 0.406: PIC.36 95.71,45.26 95.25,45.72 95.25,46.99 94.61,47.62 v92.08,47.62 | R11.1 79.38,39.69 80.01,40.32 v82.87,40.32
  Bottom 0.406: v92.08,47.62 83.5,47.62 82.87,46.99 v82.87,40.32
CS  (via drill 0.3 pad 1.42)
  Top 0.406: R6.1 70.8,42.55 71.12,42.86 71.12,48.26 71.75,48.9 v77.15,48.9 84.14,48.9 84.45,48.58 IC2.12 | PIC.35 96.81,46.06 96.52,46.35 96.52,47.94 95.57,48.9 v90.49,48.9
  Bottom 0.406: v77.15,48.9 v90.49,48.9
CS0-  (via drill 0.3 pad 1.42)
  Top 0.406: PIC.22 111,46.86 111.12,46.99 111.12,47.62 110.17,48.58 v110.17,49.85
  Bottom 0.406: ATA.37 120.65,12.06 120.02,12.7 120.02,19.37 119.38,20 110.81,20 110.17,20.64 v110.17,49.85
CS1-  (via drill 0.3 pad 1.42)
  Top 0.406: PIC.24 107.34,50.19 107.95,50.8 v107.95,52.7
  Bottom 0.406: ATA.38 127,10.79 119.7,10.79 119.06,11.43 119.06,18.41 118.43,19.05 108.58,19.05 107.95,19.68 v107.95,52.7
CS-3V
  Top 0.406: R9.2 69.85,19.37 70.8,20.32 70.8,25.08 | 70.8,26.99 70.8,27.94 70.48,28.26 70.48,36.83 70.8,37.15 R6.2
  Top 0.813: 70.8,25.08 (SOIC-28).11 70.8,26.99
DA0  (via drill 0.3 pad 1.42)
  Top 0.406: PIC.19 113.68,44.46 114.3,45.09 v114.3,49.53
  Bottom 0.406: ATA.35 122.56,14.61 121.92,15.24 121.92,21.27 121.28,21.91 113.35,21.91 112.71,22.54 112.71,49.21 113.03,49.53 v114.3,49.53
DA1  (via drill 0.3 pad 1.42)
  Top 0.406: PIC.20 112.57,45.26 113.03,45.72 113.03,51.12 113.35,51.44 v114.3,51.44
  Bottom 0.406: ATA.33 123.51,17.14 122.87,17.78 122.87,22.23 122.24,22.86 114.3,22.86 113.67,23.5 113.67,47.31 113.98,47.62 115.25,47.62 115.57,47.94 115.57,51.12 115.25,51.44 v114.3,51.44
DA2  (via drill 0.3 pad 1.42)
  Top 0.406: PIC.21 111.47,46.06 112.08,46.67 v112.08,52.39
  Bottom 0.406: ATA.36 127,13.34 121.28,13.34 120.97,13.65 120.97,20.32 120.33,20.95 112.39,20.95 111.76,21.59 111.76,49.85 112.08,50.16 v112.08,52.39
DCLK-3V
  Top 0.406: R24.2 85.72,36.83 85.41,37.15 | 85.41,37.15 R23.2 | 85.41,37.15 82.87,37.15 82.23,36.51 82.23,26.99
  Top 0.813: (SOIC-28).2 82.23,26.99 82.23,25.08
DD0  (via drill 0.3 pad 1.42)
  Top 0.406: v123.51,37.47 123.51,33.34 122.87,32.7 106.36,32.7 105.74,33.33 PIC.8
  Bottom 0.406: v123.51,37.47 ATA.17
DD1  (via drill 0.3 pad 1.42)
  Top 0.406: v123.51,40.01 122.56,40.01 122.24,39.69 122.24,34.29 121.6,33.66 107,33.66 106.54,34.11 PIC.9
  Bottom 0.406: v123.51,40.01 ATA.15
DD2  (via drill 0.3 pad 1.42)
  Top 0.406: PIC.10 107.34,35.22 107.95,34.61 120.65,34.61 121.28,35.24 121.28,41.91 121.92,42.55 v122.56,42.55
  Bottom 0.406: v122.56,42.55 ATA.13
DD3  (via drill 0.3 pad 1.42)
  Top 0.406: PIC.11 108.14,36.01 108.58,35.56 119.7,35.56 120.33,36.2 120.33,44.45 120.97,45.09 v122.56,45.09
  Bottom 0.406: v122.56,45.09 ATA.11
DD4  (via drill 0.3 pad 1.42)
  Top 0.406: PIC.14 118.89,40.46 119.38,40.96 119.38,46.99 120.02,47.62 v122.56,47.62
  Bottom 0.406: v122.56,47.62 ATA.9
DD5  (via drill 0.3 pad 1.42)
  Top 0.406: PIC.15 117.78,41.26 118.43,41.91 118.43,49.53 119.06,50.16 v122.56,50.16
  Bottom 0.406: v122.56,50.16 ATA.7
DD6  (via drill 0.3 pad 1.42)
  Top 0.406: PIC.16 116.99,42.06 117.47,42.55 117.47,52.07 118.11,52.7 v122.56,52.7 123.51,52.7 123.83,53.02 123.83,60.64 123.19,61.28 118.11,61.28 117.47,61.91 117.47,64.77 116.84,65.41 113.35,65.41 112.71,66.04 v112.71,69.85
  Bottom 0.406: v122.56,52.7 ATA.5 | v112.71,69.85 ICSP.1
DD7  (via drill 0.3 pad 1.42)
  Top 0.406: 109.86,42.86 PIC.17 115.89,42.86 116.52,43.5 116.52,55.24 | 116.52,55.24 v122.56,55.24 | 116.52,55.24 116.52,63.82 115.89,64.45 110.81,64.45 110.17,65.09 v110.17,69.85
  Bottom 0.406: v122.56,55.24 ATA.3 | v110.17,69.85 ICSP.2
DD8  (via drill 0.3 pad 1.42)
  Top 0.406: PIC.38 94.45,43.66 93.03,45.09 v92.08,45.09
  Bottom 0.406: ATA.4 127,56.52 120.02,56.52 116.84,59.69 101.28,59.69 100.65,59.05 100.65,46.04 99.69,45.09 v92.08,45.09
DD9  (via drill 0.3 pad 1.42)
  Top 0.406: PIC.39 93.98,42.86 93.03,43.81 v90.49,43.81
  Bottom 0.406: ATA.6 127,53.98 121.28,53.98 116.52,58.74 102.23,58.74 101.6,58.1 101.6,44.45 100.97,43.81 v90.49,43.81
DD10  (via drill 0.3 pad 1.42)
  Top 0.406: v92.08,42.55 93.03,42.55 93.51,42.06 PIC.40
  Bottom 0.406: ATA.8 127,51.44 120.02,51.44 119.38,52.07 119.38,54.61 116.2,57.78 103.5,57.78 102.55,56.83 102.55,43.5 101.6,42.55 v92.08,42.55
DD11  (via drill 0.3 pad 1.42)
  Top 0.406: PIC.41 97.17,41.26 97.16,41.27 v90.49,41.27
  Bottom 0.406: ATA.10 127,48.9 119.06,48.9 118.43,49.53 118.43,54.29 115.89,56.83 104.46,56.83 103.5,55.88 103.5,42.23 102.55,41.27 v90.49,41.27
DD12  (via drill 0.3 pad 1.42)
  Top 0.406: PIC.2 100.94,28.28 101.6,27.62 v117.79,27.62
  Bottom 0.406: ATA.12 127,43.81 118.43,43.81 117.79,43.18 v117.79,27.62
DD13  (via drill 0.3 pad 1.42)
  Top 0.406: PIC.3 101.74,29.7 102.55,28.89 v119.38,28.89
  Bottom 0.406: ATA.14 127,41.27 120.02,41.27 119.38,40.64 v119.38,28.89
DD14  (via drill 0.3 pad 1.42)
  Top 0.406: PIC.4 102.54,30.81 103.19,30.16 v120.65,30.16
  Bottom 0.406: ATA.16 127,38.73 121.28,38.73 120.65,38.1 v120.65,30.16
DD15  (via drill 0.3 pad 1.42)
  Top 0.406: PIC.5 103.34,31.91 103.82,31.43 v121.92,31.43
  Bottom 0.406: ATA.18 127,36.2 122.56,36.2 121.92,35.56 v121.92,31.43
DIOR-  (via drill 0.3 pad 1.42)
  Top 0.406: PIC.27 104.94,53.17 104.78,53.34 v104.78,54.93
  Bottom 0.406: ATA.25 123.19,27.3 120.65,24.77 116.2,24.77 115.25,25.72 115.25,46.04 116.52,47.31 116.52,53.02 115.25,54.29 111.76,54.29 110.81,55.24 106.68,55.24 106.36,54.93 v104.78,54.93
DIOW-  (via drill 0.3 pad 1.42)
  Top 0.406: PIC.26 105.74,50.47 105.73,50.48 105.73,54.29 107,55.56 v112.39,55.56
  Bottom 0.406: v112.39,55.56 115.57,55.56 117.47,53.66 117.47,46.67 116.2,45.4 116.2,26.67 116.84,26.04 119.7,26.04 123.51,29.84 ATA.23
DREQ
  Top 0.406: PIC.32 100.94,49.87 100.65,50.16 93.03,50.16 92.39,50.8 92.39,54.29 91.76,54.93 84.77,54.93 84.45,54.61 IC2.3
DREQ-3V  (via drill 0.3 pad 1.42)
  Top 0.406: 87,51.44 88.58,51.44 88.9,51.75 v88.9,53.34 | 87,51.44 86.04,51.44 85.72,51.75 IC2.2 85.72,53.34 | 83.5,26.99 v83.5,31.75 | 87,51.44 IC2.1
  Top 0.813: 83.5,25.08 (SOIC-28).1 83.5,26.99
  Bottom 0.406: v83.5,31.75 83.5,37.47 83.19,37.78 80.96,37.78 80.64,38.1 80.64,47.31 80.33,47.62 75.88,47.62 75.56,47.94 75.56,52.7 76.2,53.34 v88.9,53.34
DSYNC-3V
  Top 0.406: 85.09,24.13 80.01,24.13 79.69,24.45 79.69,26.99 79.69,28.89 79.38,29.21 R11.2 | 85.09,24.13 85.41,24.13 | R12.2 89.85,24.45 89.53,24.13 85.09,24.13
  Top 0.813: 79.69,25.08 (SOIC-28).4 79.69,26.99
GND  (via drill 0.3 pad 1.27, 0.3 pad 1.42, 0.3 pad 2.54)
  Top 0.406: 72.39,36.51 C14.2 | 72.39,36.51 71.44,36.51 71.12,36.2 71.12,28.89 72.07,27.94 72.07,26.99 | (SOIC-28).18 70.8,15.24 | 70.8,17.78 61.91,17.78 61.59,18.1 61.59,19.37 | 61.59,19.37 R9.1 | 61.59,21.59 61.59,19.37 | 61.59,21.59 R8.1 | 72.07,25.08 72.07,19.68 70.8,18.41 70.8,17.78 | 70.8,17.78 74.61,17.78 | 82.23,15.88 82.23,16.19 (SOIC-28).27 | 74.61,17.78 79.69,17.78 | 79.69,17.78 81.92,17.78 82.23,17.46 82.23,14.29 | 74.61,17.78 74.61,16.19 | 79.69,14.29 C28.1 | 75.56,9.21 C26.1 | 61.59,23.81 61.59,21.59 | 61.59,23.81 R4.1 | 61.59,19.37 C25.1 | 61.59,21.59 C24.1 | 100.01,55.88 C7.1 | 100.01,55.88 C6.1 | 100.01,55.88 98.11,55.88 97.16,56.83 94.93,56.83 94.61,57.15 94.61,61.28 95.25,61.91 100.01,61.91 | 100.01,61.91 102.55,61.91 102.55,52.7 103.34,51.92 PIC.29 103.34,43.66 104.14,42.86 PIC.6 104.14,35.88 104.46,35.56 v104.46,33.66 | C8.1 105.09,66.04 105.41,65.72 105.41,65.09 105.09,64.77 100.01,64.77 | 61.59,23.81 C11.1 | 100.01,63.18 C9.1 | 100.01,64.77 100.01,63.18 | 100.01,63.18 100.01,61.91 | v109.22,16.83 IC3.15 100.97,16.83 100.33,17.46 100.33,20 | 79.69,17.78 79.69,16.19 | 74.61,14.29 74.61,13.65 73.98,13.02 73.98,9.53 74.3,9.21 75.56,9.21 | 70.8,17.78 70.8,16.19 | v77.15,29.53 77.15,26.99 | 75.56,9.21 75.56,9.53 | 87.95,31.43 C21.1 | v87.95,29.53 87.95,31.43 | v77.15,54.61 78.74,54.61 79.38,53.98 IC2.7 | 89.85,31.43 R12.1 | 89.85,31.43 C5.1 | R24.1 85.72,31.75 86.04,31.43 87.95,31.43 | 87.95,31.43 89.85,31.43 | 41.91,74.93 R16.1 41.59,74.93 | 72.39,36.51 74.3,36.51 74.61,36.2 C15.2 | 100.01,64.77 99.06,64.77 98.11,65.72 98.11,75.88 | 61.59,23.81 61.59,26.35 61.91,26.67 v65.41,26.67 | C12.1 100.65,22.86 100.33,22.54 100.33,20
  Top 0.406: v101.92,20 100.33,20
  Top 0.61: R19.1 21.27,75.56 20.95,75.25 20.95,73.98 21.27,73.66 v28.89,73.66 32.07,73.66 32.7,74.3 C27.1 | 40.32,74.93 40.32,73.66 40.96,73.03 v50.8,73.03 61.91,73.03 63.82,71.12 72.07,71.12 | 40.32,74.93 C4.1 | 72.07,71.12 v76.52,71.12 76.52,58.1 75.56,57.15 66.67,57.15 66.04,56.52 66.04,34.92 65.41,34.29 v65.41,26.67 | 40.32,74.93 41.59,74.93 | 72.07,71.12 C31.1 | C13.2 107.31,77.47 107.63,77.15 v107.63,75.88 98.11,75.88 95.57,75.88 | C10.1 95.89,77.47 95.57,77.15 95.57,75.88 | 95.57,75.88 R15.1
  Top 0.813: v120.65,79.06 C30.1 | 82.23,14.29 82.23,16.19 | (SOIC-28).25 79.69,14.29 79.69,16.19 | (SOIC-28).21 74.61,16.19 74.61,14.29 | 70.8,14.29 (SOIC-28).18 70.8,16.19 | 77.15,25.08 (SOIC-28).6 77.15,26.99 | (SOIC-28).10 72.07,25.08 72.07,26.99
  Bottom 0.406: 130.18,32.38 130.18,29.84 | 130.18,29.84 130.18,27.3 | 130.18,27.3 130.18,22.23 | 130.18,22.23 130.18,10.16 129.54,9.53 ATA.40 | 130.18,63.18 130.18,57.78 | 130.18,57.78 130.18,32.38 | 6.35,47.62 6.43,47.55 | ATA.19 ATA.22 130.18,32.38 | 130.18,29.84 ATA.24 | 130.18,27.3 ATA.26 | 130.18,22.23 ATA.30 | 130.18,57.78 ATA.2 | v107.63,75.88 ICSP.3 | v109.22,16.83 SV1.3 | v101.92,20 103.82,20 105.09,21.27 105.09,28.26 104.46,28.89 v104.46,33.66 | 50.8,68.58 U$2.A | 41.27,72.39 41.27,73.98 41.59,74.3 | C23.- C22.- 59.44,13.91 60.01,13.34 60.01,12.06 60.64,11.43 64.45,11.43 65.41,12.38 v65.41,26.67 76.52,26.67 77.15,27.3 v77.15,29.53 v87.95,29.53 87.95,13.02 88.2,12.76 C35.+ | 91.12,54.61 v77.15,54.61 | 30.8,68.58 U$4.A
  Bottom 0.61: 31.11,73.66 v28.89,73.66 | NAPAJENI_DISKU.3 122.59,76.8 122.56,76.83 122.87,77.47
  Bottom 0.813: 130.18,71.75 130.18,63.18 108.58,63.18 107.63,64.14 107.63,66.67 | 122.87,77.47 122.87,78.74 122.56,79.06 v120.65,79.06 | 107.63,66.67 v107.63,75.88 | v76.52,71.12 79.38,71.12 C3.- 83.76,71.18 83.82,71.12 C29.- | 91.12,54.61 91.76,55.24 91.76,65.72 92.71,66.67 107.63,66.67 | 3.49,47.62 3.49,45.4 2.3,44.21 X1.1 2.3,40.4 2.22,40.32 2.22,27.62 3.49,26.35 17.78,26.35 18.41,25.72 X2.5
  Bottom 1.27: 3.53,77.51 3.49,76.52 3.49,47.62 6.03,47.62 | 31.11,68.58 30.8,68.58 27.3,68.58 25.4,70.48 LM2576-12.GND | 6.03,47.62 6.35,47.62 21.91,47.62 | 31.11,45.09 31.11,68.58 | LM2576-5.EN 49.53,81.28 50.8,80.01 v50.8,73.03 50.8,68.58 50.8,64.14 | LM2576-12.EN 30.48,78.74 31.11,78.11 31.11,73.66 31.11,68.58 | 31.11,45.09 43.5,45.09 44.77,46.35 44.77,64.14 | LM2576-5.GND 41.27,72.39 44.77,68.9 44.77,64.14 | 54.61,64.14 D1.A | 44.77,64.14 50.8,64.14 | 50.8,64.14 54.61,64.14 | 54.61,64.14 58.42,64.14 59.37,65.09 C1.- 67.82,80.45 67.94,80.33 C17.- 67.94,80.64 69.53,80.64 70.17,81.28 70.17,83.19 71.44,84.45 129.22,84.45 130.18,83.5 130.18,76.83 130.18,71.75 129.86,71.75 129.82,71.8 | NAPAJENI_DISKU.3 129.58,76.8 | 31.11,45.09 29.21,45.09 26.67,47.62 21.91,47.62 | NAPAJENI.2 8.85,77.51 8.89,77.47 | 126.36,71.8 126.36,71.75 126.41,71.8 NAPAJENI_DISKU.2 | C16.- C2.- 32.38,30.8 31.43,31.75 26.35,31.75 21.91,36.2 21.91,47.62 | 6.03,47.62 21.91,47.62
  Bottom 2.54: 3.53,77.51 1.95,77.51 1.91,77.47 8.89,77.47 | 129.82,71.8 NAPAJENI_DISKU.2 126.36,71.8 122.91,71.8 122.87,71.75 | 130.13,76.8 130.18,76.83 122.56,76.83
HD_LED
  Bottom 0.406: ATA.39 125.73,6.03 124.78,5.08 91.76,5.08 91.12,5.71 40.32,5.71 36.83,9.21 12.7,9.21 12.06,9.84 12.06,20.32 12.9,21.16 X2.4
MCLR-  (via drill 0.3 pad 1.42)
  Top 0.406: PIC.18 115.1,43.66 115.57,44.13 115.57,62.87 114.94,63.5 109.54,63.5 108.9,64.14 108.9,74.3 108.58,74.61 100.33,74.61 100.01,74.3 v100.01,69.85 100.01,68.26 | 100.01,68.26 R5.1 | 100.01,68.26 100.01,66.36 100.33,66.04 C8.2
  Bottom 0.813: v100.01,69.85 ICSP.6
N$1  (via drill 0.3 pad 2.54)
  Bottom 1.27: 11.15,82.51 11.75,81.92 11.75,72.07 11.11,71.44 v7.62,71.44 F2.1A | 4.76,82.51 4.76,82.55 4.8,82.51 NAPAJENI.1
  Bottom 2.54: 11.15,82.51 NAPAJENI.1 4.76,82.51 2.26,82.51 2.22,82.55
N$2  (via drill 0.3 pad 1.42)
  Top 0.406: PIC.31 101.74,50.98 101.28,51.44 100.01,51.44 | v96.2,51.44 100.01,51.44 | 100.01,51.44 C7.2
  Bottom 0.406: v96.2,51.44 Q1.1
N$3  (via drill 0.3 pad 3.81)
  other vias: 3,87
N$4  (via drill 0.3 pad 2.54)
  other vias: 7.62,82.55
N$5  (via drill 0.3 pad 1.42)
  Top 0.406: PIC.30 102.54,51.45 101.6,52.39 101.6,60.01 101.28,60.33 v100.01,60.33 C6.2
  Bottom 0.406: v100.01,60.33 Q1.2
N$6  (via drill 0.3 pad 2.54)
  other vias: 7.62,77.47
N$7
  Top 0.813: 66.99,16.19 (SOIC-28).15 R14.1
N$8  (via drill 0.3 pad 1.42)
  Top 0.406: 74.61,27.94 R2.1 | C14.1 v72.39,30.16 72.39,28.89 73.34,27.94 74.61,27.94 | 74.61,26.99 74.61,27.94
  Top 0.813: 74.61,25.08 (SOIC-28).8 74.61,26.99
  Bottom 0.406: Q2.1 73.03,39.69 72.39,39.05 v72.39,30.16
N$9  (via drill 0.3 pad 1.42)
  Top 0.406: 75.88,31.75 74.61,31.75 | 74.61,31.75 R2.2 | 74.61,31.75 C15.1 | v76.52,34.92 76.52,32.38 75.88,31.75 | 75.88,26.99 75.88,31.75
  Top 0.813: 75.88,25.08 (SOIC-28).7 75.88,26.99
  Bottom 0.406: Q2.2 75.88,44.77 76.52,44.13 v76.52,34.92
N$11
  Top 0.406: C26.2 75.56,13.34 75.88,13.65 75.88,14.29
  Top 0.813: 75.88,16.19 (SOIC-28).22 75.88,14.29
N$12
  Bottom 0.813: X1.5 9.07,35.74 9.84,36.51 9.84,38.1 10.48,38.73 17.78,38.73 18.41,38.1 18.41,35.56 25.72,28.26 25.72,14.92 27.3,13.34 C18.-
N$13
  Bottom 0.813: X1.2 19.23,45.54 20,44.77 20,35.88 27.3,28.57 27.3,21.27 28.89,19.68 C19.-
N$14  (via drill 0.3 pad 1.42)
  Top 0.406: v46.04,12.7 R10.1
  Bottom 0.813: C18.+ 42.23,13.34 42.86,12.7 v46.04,12.7
N$15  (via drill 0.3 pad 1.42)
  Top 0.406: v46.04,21.27 R25.1
  Bottom 0.813: v46.04,21.27 46.04,20.32 45.4,19.68 C19.+
N$16  (via drill 0.3 pad 2.54)
  other vias: 7.62,66.36
N$17  (via drill 0.3 pad 2.54)
  other vias: 7.62,55.56
N$18  (via drill 0.3 pad 2.54)
  other vias: 7.62,50.48
N$20  (via drill 0.3 pad 1.78)
  other vias: 17.76,68.61
N$21  (via drill 0.3 pad 2.54)
  other vias: 31.29,68.55
N$23
  Top 0.406: R13.1 83.5,7.94 83.19,7.62 81.28,7.62 | C28.2 79.69,7.94 80.01,7.62 81.28,7.62 | 81.28,7.62 81.28,13.34 80.96,13.65 80.96,14.29
  Top 0.813: 80.96,16.19 (SOIC-28).26 80.96,14.29
N$25  (via drill 0.3 pad 2.54)
  Top 0.61: C27.2 32.7,79.38 33.34,80.01 v33.34,81.6
  Bottom 0.61: 33.34,83.82 v33.34,81.6
  Bottom 1.27: F2.2A 13.4,50.55 13.97,51.12 13.97,80.33 14.92,81.28 LM2576-12.IN 20.32,83.19 20.95,83.82 33.34,83.82 36.2,83.82 | 36.2,83.82 LM2576-5.IN | 36.2,83.82 54.61,83.82 | 54.61,83.82 D1.C | 54.61,83.82 59.37,83.82 C1.+ C17.+ 67.94,84.14
N$27  (via drill 0.25 pad 1.78)
  other vias: 37.53,68.63
N$28  (via drill 0.3 pad 1.27)
  Top 0.61: v86.04,70.17 87.31,70.17 87.95,69.53 87.95,66.04 88.58,65.41 92.08,65.41 | R15.2 95.57,65.72 95.25,65.41 92.08,65.41 | 92.08,65.41 R26.1
  Bottom 0.61: 86.04,74.61 85.72,74.93
  Bottom 0.813: C29.+ 85.47,72.96 86.04,72.71 | D5.A v86.04,70.17 86.04,72.71 | 85.72,74.93 LM317.1 | 86.04,72.71 86.04,74.61
N$29  (via drill 0.3 pad 3.81)
  Bottom 1.27: 22.86,68.58 LM2576-12._OUT | 22.86,68.58 24.13,68.58 25.4,67.31 L4.1 v25.4,64.14 | U$4.K 22.86,68.58
N$30  (via drill 0.3 pad 1.42)
  Top 0.406: IC3.14 115.25,15.56 115.89,14.92 v115.89,11.75
  Bottom 0.406: v115.89,11.75 SV1.1
N$31
  Bottom 1.27: LM2576-5._OUT 38.73,78.42 37.47,77.15 U$2.K 37.47,60.33 40.94,56.22 L3.1
N$32
  Top 0.61: R18.1 R17.2
N$33  (via drill 0.3 pad 2.54)
  Top 0.61: R17.1 v46.99,77.47 46.99,75.56 46.35,74.93 R16.2
  Bottom 0.61: LM2576-5.FB 43.81,78.11 44.45,77.47 v46.99,77.47
N$34  (via drill 0.3 pad 1.42)
  Top 0.406: IC3.13 v109.22,14.29
  Bottom 0.406: v109.22,14.29 SV1.2
N$35  (via drill 0.3 pad 2.54)
  Top 0.61: R20.1 v27.94,78.11 27.94,76.2 27.3,75.56 R19.2
  Bottom 0.61: v27.94,78.11 LM2576-12.FB
N$36  (via drill 0.3 pad 1.42)
  Top 0.406: v93.34,11.75 IC3.6
  Bottom 0.406: v93.34,11.75 91.76,11.75 91.12,11.11 C35.-
N$37  (via drill 0.3 pad 1.42)
  Top 0.406: IC3.2 97.16,16.83 97.47,17.14 v97.47,20.64
  Bottom 0.406: v97.47,20.64 97.47,28.89 97.16,29.21 96.2,29.21 C34.+
N$38  (via drill 0.3 pad 1.42)
  Top 0.406: v92.08,13.02 IC3.5
  Bottom 0.406: v92.08,13.02 89.53,13.02 89.22,13.34 C33.- 89.22,15.88
N$39  (via drill 0.3 pad 1.42)
  Top 0.406: IC3.3 93.66,15.56 92.39,16.83 v92.39,19.37
  Bottom 0.406: C32.- 93.09,25.78 92.39,25.08 v92.39,19.37
N$40  (via drill 0.3 pad 1.42)
  Top 0.406: IC3.1 93.98,18.1 93.66,18.41 v93.66,21.59
  Bottom 0.406: v93.66,21.59 93.66,23.18 94.23,23.75 C32.+
N$41  (via drill 0.3 pad 1.42)
  Top 0.406: v93.34,14.29 IC3.4
  Bottom 0.406: v93.34,14.29 91.76,14.29 91.12,14.92 91.12,17.46 90.74,17.84 C33.+
N$42  (via drill 0.3 pad 1.78)
  other vias: 50.94,68.55
N$43  (via drill 0.3 pad 2.54)
  other vias: 54.61,69.21
N$44  (via drill 0.3 pad 2.54)
  other vias: 54.62,79.33
N$45  (via drill 0.3 pad 1.78)
  other vias: 20.32,81.31
N$46  (via drill 0.3 pad 1.78)
  other vias: 22.88,81.25
N$47  (via drill 0.3 pad 1.78)
  other vias: 25.39,81.29
N$48  (via drill 0.3 pad 1.78)
  other vias: 27.95,81.31
N$49  (via drill 0.3 pad 1.78)
  other vias: 30.53,81.29
N$50  (via drill 0.3 pad 1.78)
  other vias: 46.38,81.25
N$51  (via drill 0.3 pad 1.78)
  other vias: 43.82,81.31
N$52  (via drill 0.3 pad 1.78)
  other vias: 41.3,81.31
N$53  (via drill 0.3 pad 1.78)
  other vias: 38.76,81.29
N$54  (via drill 0.3 pad 1.78)
  other vias: 36.19,81.33
N$55  (via drill 0.3 pad 1.42)
  Top 0.406: v72.71,10.16 72.71,13.02 73.34,13.65 73.34,14.29 | v46.04,14.92 R25.2
  Top 0.813: 73.34,16.19 (SOIC-28).20 73.34,14.29
  Bottom 0.406: v72.71,10.16 49.21,10.16 48.58,10.79 48.58,14.61 48.26,14.92 v46.04,14.92
N$56
  Top 0.406: R10.2 46.04,6.99 46.35,6.67 77.79,6.67 78.11,6.99 78.11,13.34 78.42,13.65 78.42,14.29
  Top 0.813: 78.42,16.19 (SOIC-28).24 78.42,14.29
N$57
  Top 0.406: R23.1 85.41,42.86 85.09,43.18 83.5,43.18 83.19,43.5 IC2.11 83.19,46.99
N$58  (via drill 0.3 pad 1.42)
  other vias: 82.86,57.45
N$59  (via drill 0.3 pad 1.42)
  other vias: 86.06,57.45
N$60  (via drill 0.3 pad 1.42)
  other vias: 90.78,77.19
N$61  (via drill 0.3 pad 1.42)
  other vias: 88.26,77.15
N$62  (via drill 0.3 pad 1.42)
  other vias: 85.7,77.15
N$63  (via drill 0.3 pad 1.42)
  other vias: 86.06,67.59
N$64  (via drill 0.3 pad 1.42)
  other vias: 82.9,67.63
N$65  (via drill 0.3 pad 1.42)
  other vias: 49.54,27.28
N$66  (via drill 0.3 pad 1.42)
  other vias: 49.54,34.93
N$67  (via drill 0.3 pad 1.42)
  other vias: 32.4,34.93
N$68  (via drill 0.3 pad 1.42)
  other vias: 83.84,72.95
N$69  (via drill 0.3 pad 1.42)
  other vias: 83.82,71.19
N$70  (via drill 0.3 pad 1.42)
  other vias: 79.37,72.96
N$71  (via drill 0.3 pad 1.42)
  other vias: 79.38,71.19
N$72  (via drill 0.3 pad 1.42)
  other vias: 32.36,27.28
N$73  (via drill 0.3 pad 1.42)
  other vias: 40.64,13.35
N$74  (via drill 0.3 pad 1.42)
  other vias: 40.33,19.67
N$75  (via drill 0.3 pad 1.42)
  other vias: 37.8,19.64
N$76  (via drill 0.3 pad 1.42)
  other vias: 38.08,13.35
N$77  (via drill 0.3 pad 1.78)
  other vias: 10.13,45.55
N$78  (via drill 0.3 pad 2.54)
  other vias: 127.04,81.8
N$79  (via drill 0.3 pad 2.54)
  other vias: 127.01,76.83
N$80  (via drill 0.3 pad 2.54)
  other vias: 127.01,71.78
N$81  (via drill 0.3 pad 2.54)
  other vias: 127.03,66.75
N$82  (via drill 0.3 pad 1.42)
  other vias: 96.2,60.31
N$83  (via drill 0.3 pad 1.42)
  other vias: 96.2,55.24
N$84  (via drill 0.3 pad 1.42)
  other vias: 128.28,57.79
N$85  (via drill 0.3 pad 1.42)
  other vias: 125.75,57.8
N$86  (via drill 0.3 pad 1.42)
  other vias: 125.72,55.26
N$87  (via drill 0.3 pad 1.42)
  other vias: 128.3,55.23
N$88  (via drill 0.3 pad 1.42)
  other vias: 128.28,52.68
N$89  (via drill 0.3 pad 1.42)
  other vias: 125.72,52.7
N$90  (via drill 0.3 pad 1.42)
  other vias: 125.74,50.16
N$91  (via drill 0.3 pad 1.42)
  other vias: 125.71,47.63
N$92  (via drill 0.3 pad 1.42)
  other vias: 128.3,47.63
N$93  (via drill 0.3 pad 1.42)
  other vias: 128.28,50.16
N$94  (via drill 0.3 pad 1.42)
  other vias: 128.31,45.09
N$95  (via drill 0.3 pad 1.42)
  other vias: 125.7,45.11
N$96  (via drill 0.3 pad 1.42)
  other vias: 125.73,42.59
N$97  (via drill 0.3 pad 1.42)
  other vias: 128.29,42.57
N$98  (via drill 0.3 pad 1.42)
  other vias: 128.28,40.02
N$99  (via drill 0.3 pad 1.42)
  other vias: 128.28,37.48
N$100  (via drill 0.3 pad 1.42)
  other vias: 128.24,34.92
N$101  (via drill 0.3 pad 1.42)
  other vias: 128.28,32.4
N$102  (via drill 0.3 pad 1.42)
  other vias: 125.71,34.94
N$103  (via drill 0.3 pad 1.42)
  other vias: 125.71,37.48
N$104  (via drill 0.3 pad 1.42)
  other vias: 125.73,40
N$105  (via drill 0.3 pad 1.42)
  other vias: 125.74,32.38
N$106  (via drill 0.3 pad 1.42)
  other vias: 125.7,29.85
N$107  (via drill 0.3 pad 1.42)
  other vias: 128.27,29.82
N$108  (via drill 0.3 pad 1.42)
  other vias: 128.28,27.31
N$109  (via drill 0.3 pad 1.42)
  other vias: 128.28,24.71
N$110  (via drill 0.3 pad 1.42)
  other vias: 125.76,24.75
N$111  (via drill 0.3 pad 1.42)
  other vias: 128.27,9.49
N$112  (via drill 0.3 pad 1.42)
  other vias: 125.74,9.53
N$113  (via drill 0.3 pad 1.42)
  other vias: 125.72,27.32
N$114  (via drill 0.3 pad 1.42)
  other vias: 128.27,22.22
N$115  (via drill 0.3 pad 1.42)
  other vias: 125.75,22.22
N$116  (via drill 0.3 pad 1.42)
  other vias: 125.73,19.68
N$117  (via drill 0.3 pad 1.42)
  other vias: 128.27,19.68
N$118  (via drill 0.3 pad 1.42)
  other vias: 125.73,17.16
N$119  (via drill 0.3 pad 1.42)
  other vias: 128.27,17.12
N$120  (via drill 0.3 pad 1.42)
  other vias: 128.28,14.59
N$121  (via drill 0.3 pad 1.42)
  other vias: 125.73,14.59
N$122  (via drill 0.3 pad 1.42)
  other vias: 125.71,12.08
N$123  (via drill 0.3 pad 1.42)
  other vias: 128.26,12.06
N$124  (via drill 0.3 pad 1.42)
  other vias: 112.77,11.75
N$125  (via drill 0.3 pad 1.42)
  other vias: 112.67,14.33
N$126  (via drill 0.3 pad 1.42)
  other vias: 112.69,16.86
N$127  (via drill 0.3 pad 1.78)
  other vias: 8.73,43.06
N$128  (via drill 0.3 pad 1.78)
  other vias: 2.28,40.46
N$129  (via drill 0.3 pad 1.78)
  other vias: 5.57,35.73
N$130  (via drill 0.3 pad 1.78)
  other vias: 13.02,36.25
N$131  (via drill 0.3 pad 1.02)
  other vias: 96.18,31.15
N$132  (via drill 0.3 pad 1.02)
  other vias: 96.18,29.15
N$133  (via drill 0.3 pad 1.02)
  other vias: 96.21,25.76
N$134  (via drill 0.3 pad 1.02)
  other vias: 96.21,23.75
N$135  (via drill 0.3 pad 1.02)
  other vias: 90.23,11.13
N$136  (via drill 0.3 pad 1.02)
  other vias: 88.23,11.1
N$137  (via drill 0.3 pad 1.02)
  other vias: 89.2,15.83
N$138  (via drill 0.3 pad 1.02)
  other vias: 89.23,17.83
N$139  (via drill 0.3 pad 1.02)
  other vias: 53,18.66
N$140  (via drill 0.3 pad 1.02)
  other vias: 53,16.9
N$141  (via drill 0.3 pad 3.81)
  other vias: 25.42,41.27
N$142  (via drill 0.3 pad 1.02)
  other vias: 53,13.88
N$143  (via drill 0.3 pad 1.02)
  other vias: 53.03,12.15
N$144  (via drill 0.3 pad 1.02)
  other vias: 67.93,84.05
N$145  (via drill 0.3 pad 1.02)
  other vias: 67.95,80.48
N$146  (via drill 0.3 pad 1.02)
  other vias: 59.38,80.48
N$147  (via drill 0.3 pad 1.42)
  other vias: 18.41,21.16
N$148  (via drill 0.3 pad 1.42)
  other vias: 18.41,23.89
N$149  (via drill 0.3 pad 1.42)
  other vias: 15.87,22.55
N$150  (via drill 0.3 pad 1.42)
  other vias: 15.87,19.79
N$151  (via drill 0.3 pad 1.42)
  other vias: 15.85,17.03
N$152  (via drill 0.3 pad 1.42)
  other vias: 18.41,18.42
N$153  (via drill 0.3 pad 1.42)
  other vias: 18.41,15.68
N$154  (via drill 0.3 pad 1.42)
  other vias: 18.41,12.95
N$155  (via drill 0.3 pad 1.42)
  other vias: 15.84,14.29
N$156  (via drill 0.3 pad 1.02)
  other vias: 59.35,84.02
N$157
  pour Bottom: 65.41,26.67 76.52,26.67 77.15,27.3 77.15,29.53 87.95,29.53 87.95,15.88 65.41,15.88
N$158  (via drill 0.3 pad 1.42)
  other vias: 75.26,44.75
N$159  (via drill 0.3 pad 1.42)
  other vias: 75.26,39.69
N$160  (via drill 0.3 pad 2.54)
  other vias: 63.85,52.72
N$161  (via drill 0.3 pad 3.81)
  other vias: 40.93,52.72
N$162  (via drill 0.3 pad 1.42)
  other vias: 112.73,72.37
N$163  (via drill 0.3 pad 1.42)
  other vias: 110.2,72.39
N$164  (via drill 0.3 pad 1.42)
  other vias: 107.63,72.36
N$165  (via drill 0.3 pad 1.42)
  other vias: 105.1,72.37
N$166  (via drill 0.3 pad 1.42)
  other vias: 102.55,72.36
N$167  (via drill 0.3 pad 1.42)
  other vias: 100,72.36
N$168  (via drill 0.3 pad 3.81)
  other vias: 17.13,30.92
N$169  (via drill 0.3 pad 3.81)
  other vias: 17.13,5.87
N$171  (via drill 0.3 pad 3.81)
  other vias: 131.92,87
N$172  (via drill 0.3 pad 3.81)
  other vias: 131.92,3
N$173  (via drill 0.3 pad 3.81)
  other vias: 3,3
N$174
  pour Bottom: 85.09,29.53 85.09,39.69 102.55,39.69 102.55,33.02 90.17,33.02 90.17,29.53
N$177  (via drill 0.25 pad 1.42)
  other vias: 108.86,7.62
N$178  (via drill 0.25 pad 1.42)
  other vias: 111.45,7.62
N$179  (via drill 0.25 pad 1.42)
  other vias: 114.01,7.65
RESET-  (via drill 0.3 pad 1.42)
  Top 0.406: PIC.25 106.54,53.48 106.68,53.66 107.31,54.29 113.03,54.29 113.67,54.93 v113.67,60.96
  Bottom 0.406: ATA.1 120.33,57.78 117.16,60.96 v113.67,60.96
SCLK  (via drill 0.3 pad 1.42)
  Top 0.406: PIC.37 95.24,44.46 93.34,46.35 v90.49,46.35 | IC2.13 85.72,49.21 85.41,49.53 78.74,49.53 78.11,50.16 69.85,50.16 69.53,49.85 R7.1 | IC2.13 v85.72,44.77 IC2.13
  Bottom 0.406: v90.49,46.35 86.04,46.35 85.72,46.04 v85.72,44.77
SCLK-3V
  Top 0.406: R8.2 68.9,21.59 69.53,22.23 69.53,25.08 | 69.53,26.99 69.53,36.83 69.22,37.15 69.22,43.18 69.53,43.5 R7.2
  Top 0.813: 69.53,25.08 (SOIC-28).12 69.53,26.99
SI
  Top 0.406: PIC.43 94.27,39.66 93.34,38.73 88.58,38.73 87.95,39.37 87.95,49.21 87,50.16 79.38,50.16 78.11,51.44 78.11,52.39 77.15,53.34 R3.1
SI-3V  (via drill 0.3 pad 1.42)
  Top 0.406: R4.2 67.63,23.81 68.26,24.45 68.26,25.72 | 67.94,51.75 67.94,38.42 68.26,38.1 68.26,26.99 | 67.94,51.75 67.94,53.02 68.26,53.34 R3.2 | 67.94,51.75 v73.98,51.75 | v80.96,34.92 80.96,25.08
  Top 0.813: 68.26,25.08 68.26,25.72 (SOIC-28).13 68.26,26.99 | 80.96,26.99 (SOIC-28).3 80.96,25.08
  Bottom 0.406: v80.96,34.92 79.06,34.92 78.11,35.88 78.11,45.4 77.15,46.35 74.61,46.35 73.98,46.99 v73.98,51.75
SO
  Top 0.406: PIC.42 92.85,40.46 92.08,39.69 89.53,39.69 88.9,40.32 88.9,49.85 87.95,50.8 81.28,50.8 80.64,51.44 IC2.6 80.64,53.02
SO-3V
  Top 0.406: 81.92,55.88 67.63,55.88 66.99,55.24 66.99,26.99 | 81.92,55.88 82.87,55.88 83.19,55.56 IC2.4 | 81.92,55.88 IC2.5
  Top 0.813: 66.99,25.08 (SOIC-28).14 66.99,26.99
USART_IN  (via drill 0.3 pad 1.27)
  Top 0.406: PIC.1 100.14,27.5 100.97,26.67 115.25,26.67 115.89,26.04 v115.89,17.14
  Bottom 0.406: v115.89,17.14 117.79,17.14 118.11,16.83 118.11,10.79 117.47,10.16 111.76,10.16 111.44,9.84 SV2.2
USART_IN_LCD
  Bottom 0.406: X2.2 14.4,15.67 13.97,15.24 13.97,11.75 14.61,11.11 38.1,11.11 41.59,7.62 104.14,7.62 | 104.14,7.62 104.46,7.62 | 104.14,7.62 SV2.3
USART_IN_PC  (via drill 0.3 pad 1.27)
  Top 0.406: IC3.12 107.31,13.02 107.63,12.7 107.63,10.16 107.95,9.84 117.47,9.84 117.79,9.53 v117.79,7.62
  Bottom 0.406: v117.79,7.62 SV2.1
USART_OUT  (via drill 0.3 pad 1.42)
  Top 0.406: v95.25,6.35 99.06,6.35 | 99.06,6.35 101.28,6.35 102.23,7.3 102.23,11.11 102.87,11.75 IC3.11 | PIC.44 97.28,38.86 97.16,38.73 97.16,35.88 99.06,33.97 99.06,6.35
  Bottom 0.406: v95.25,6.35 93.03,6.35 92.71,6.67 40.96,6.67 37.47,10.16 13.65,10.16 13.02,10.79 13.02,17.78 13.65,18.41 X2.3

### Text on the board
Bottom: K&B MP3 prehravac; Karas ET4A 2006